# EasyEDA Pro project RK3568_DEV.epro, schematic Schematic1, sheets 13 to 24 of 27

## Sheets
13 WIFI: Create Date: 2025-09-11; Page Name: WIFI; Project Name: RK3568B2地瓜派; Update Date: 2025-09-15
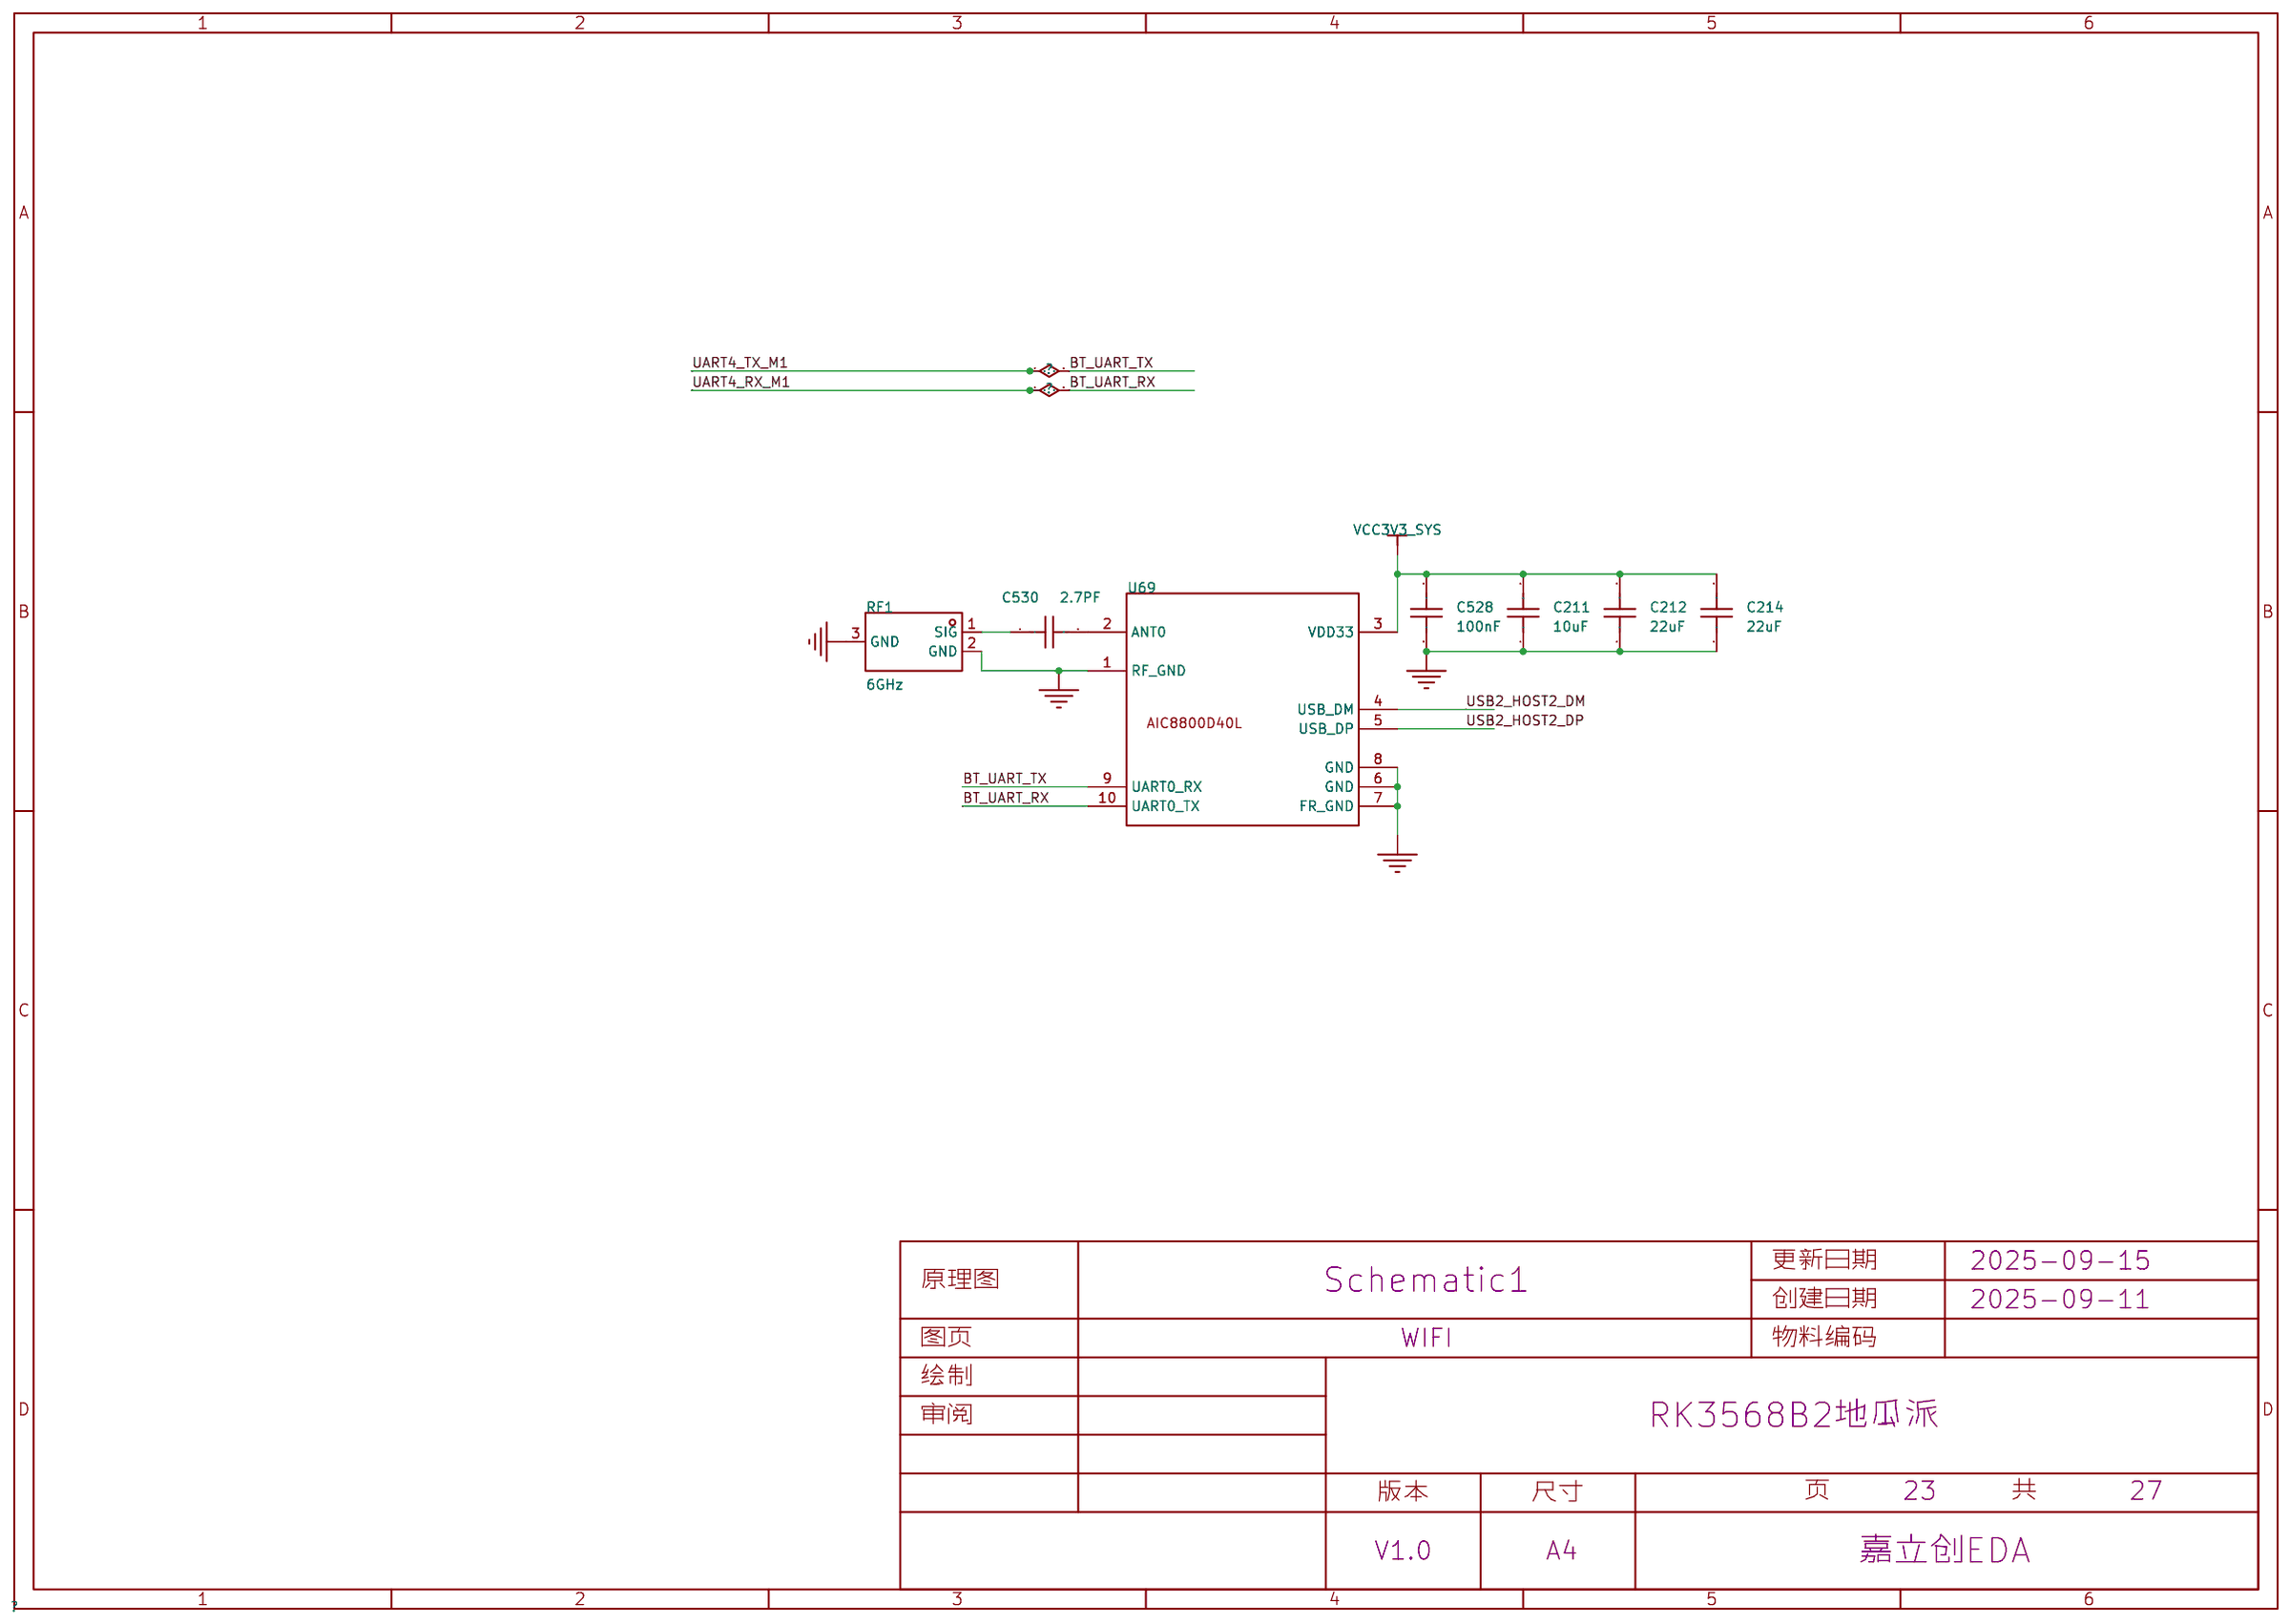
[diagram p12: WIFI]
14 SOC_MAC/SAR/I2S: Page Name: SOC_MAC/SAR/I2S
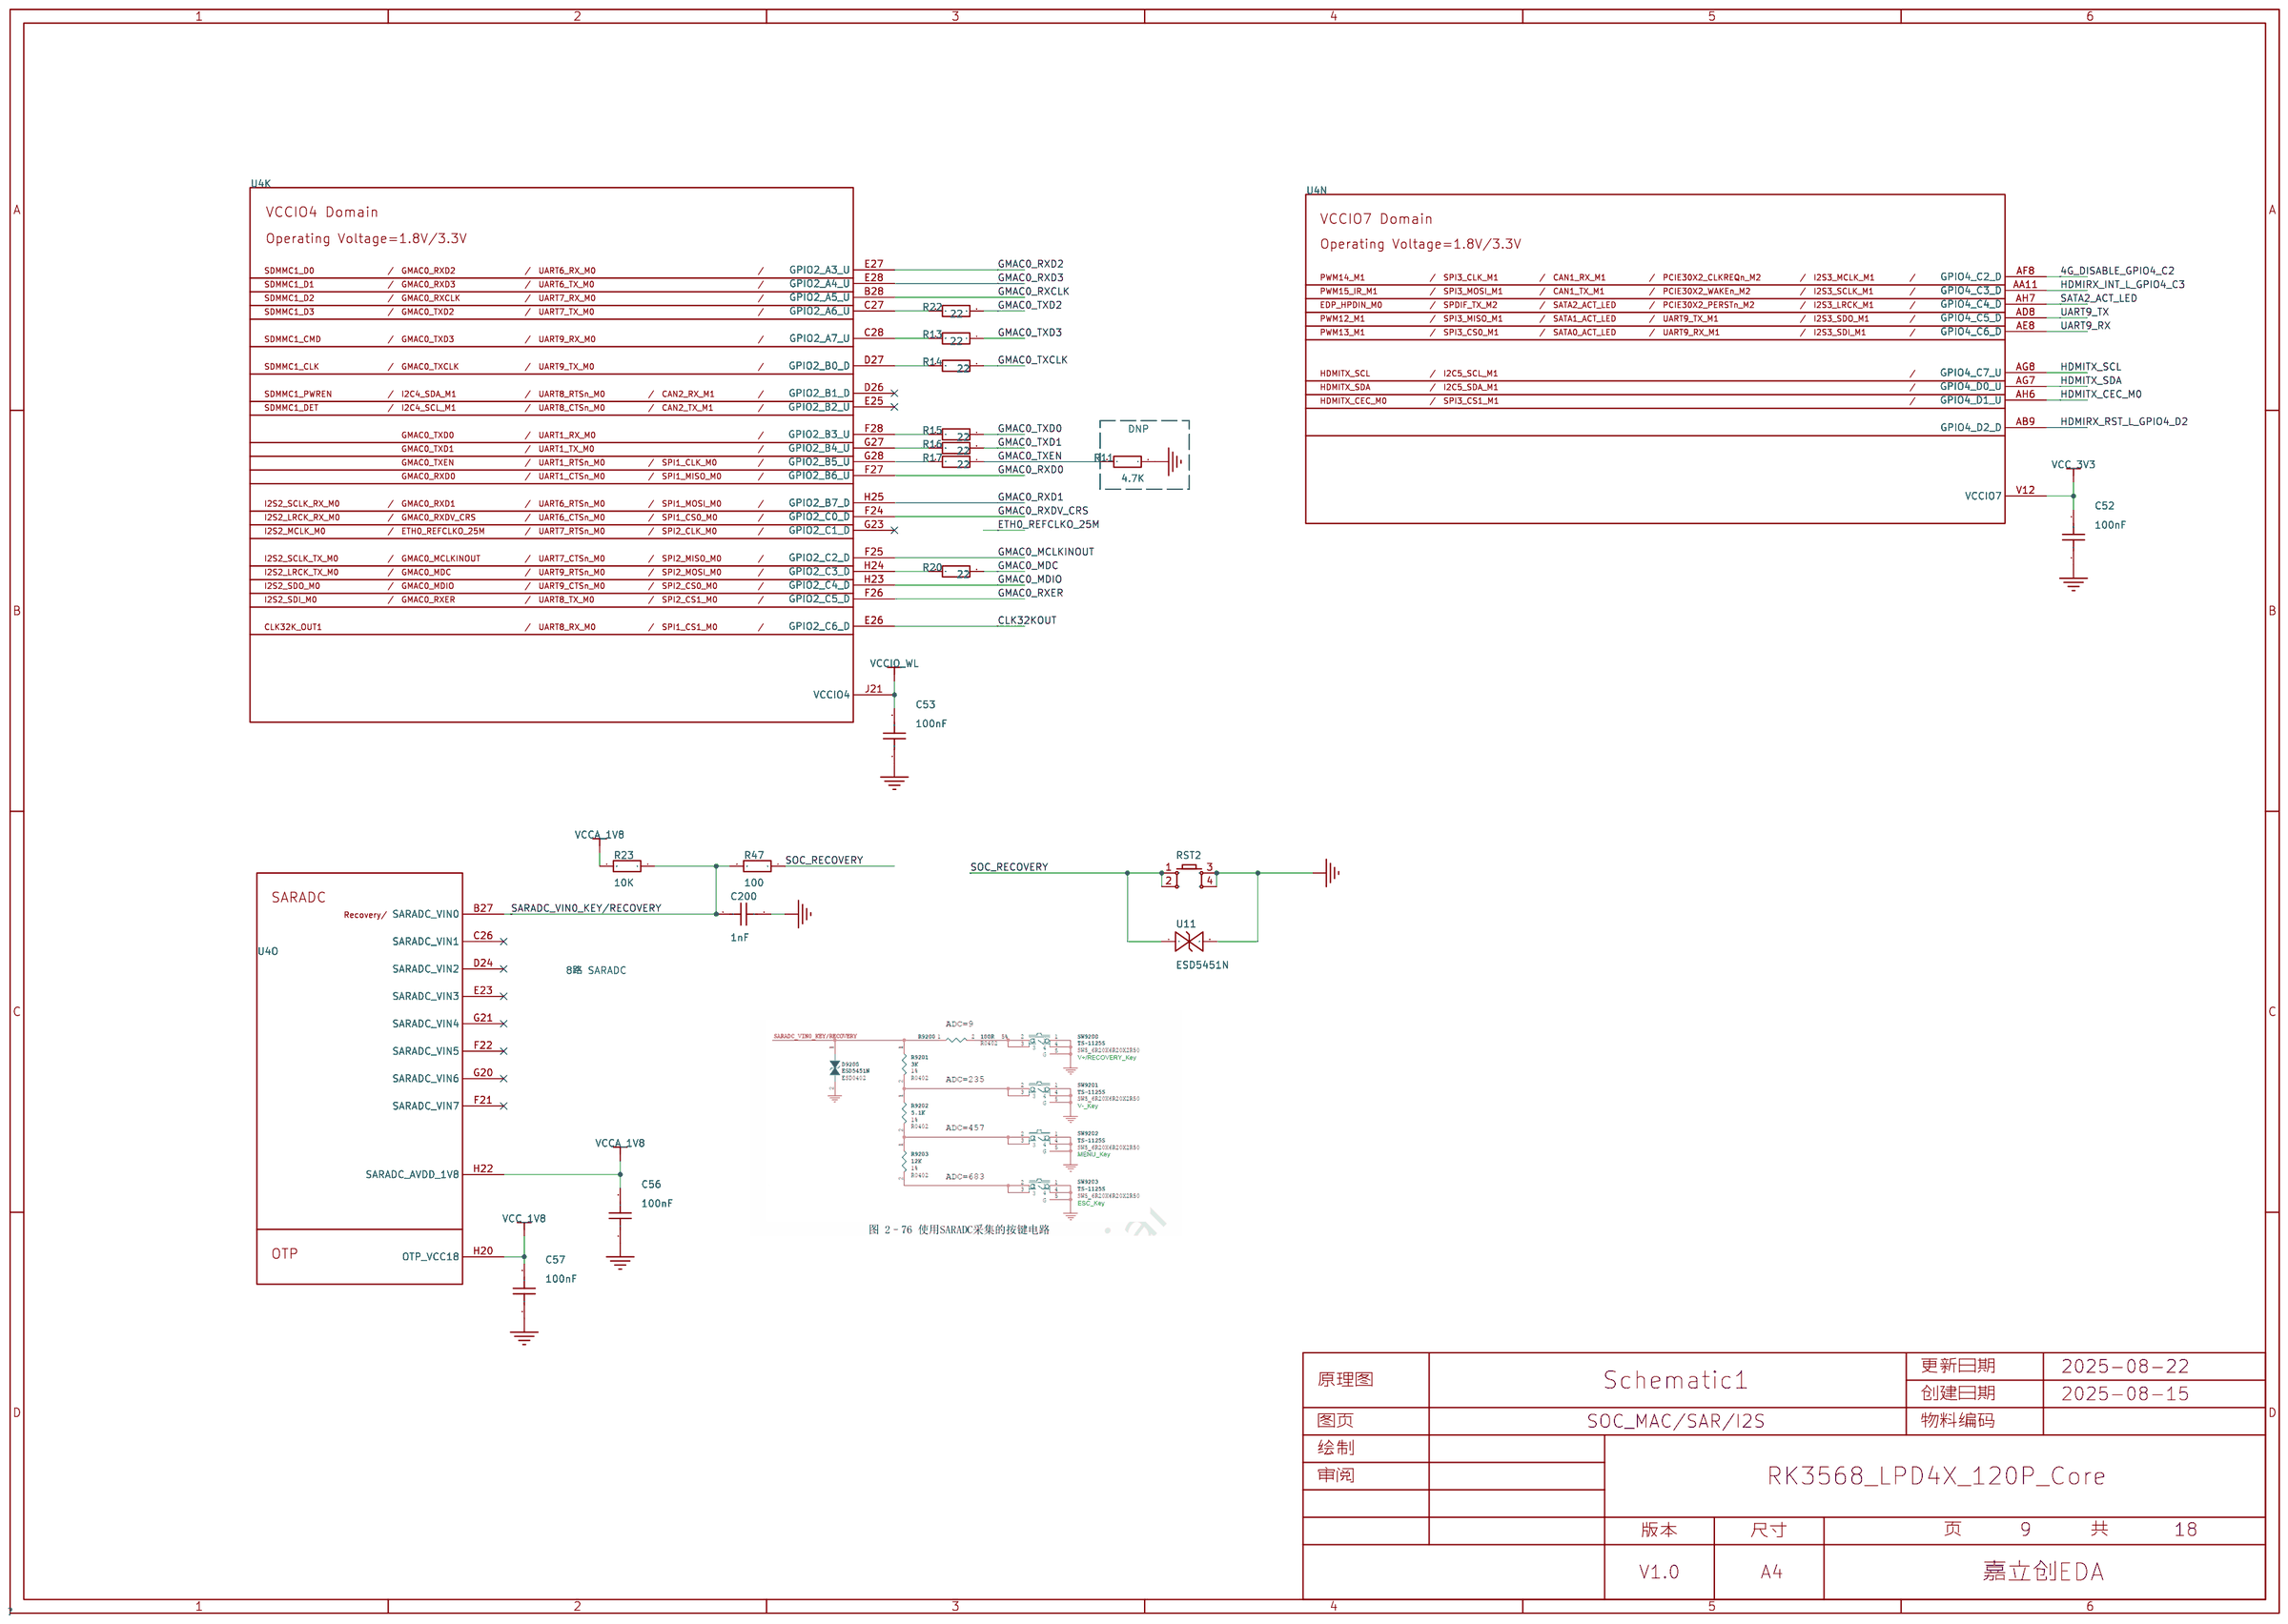
[diagram p13: SOC_MAC/SAR/I2S]
15 DISPLAY: Create Date: 2025-09-11; Page Name: DISPLAY; Project Name: RK3568B2地瓜派; Update Date: 2025-09-23
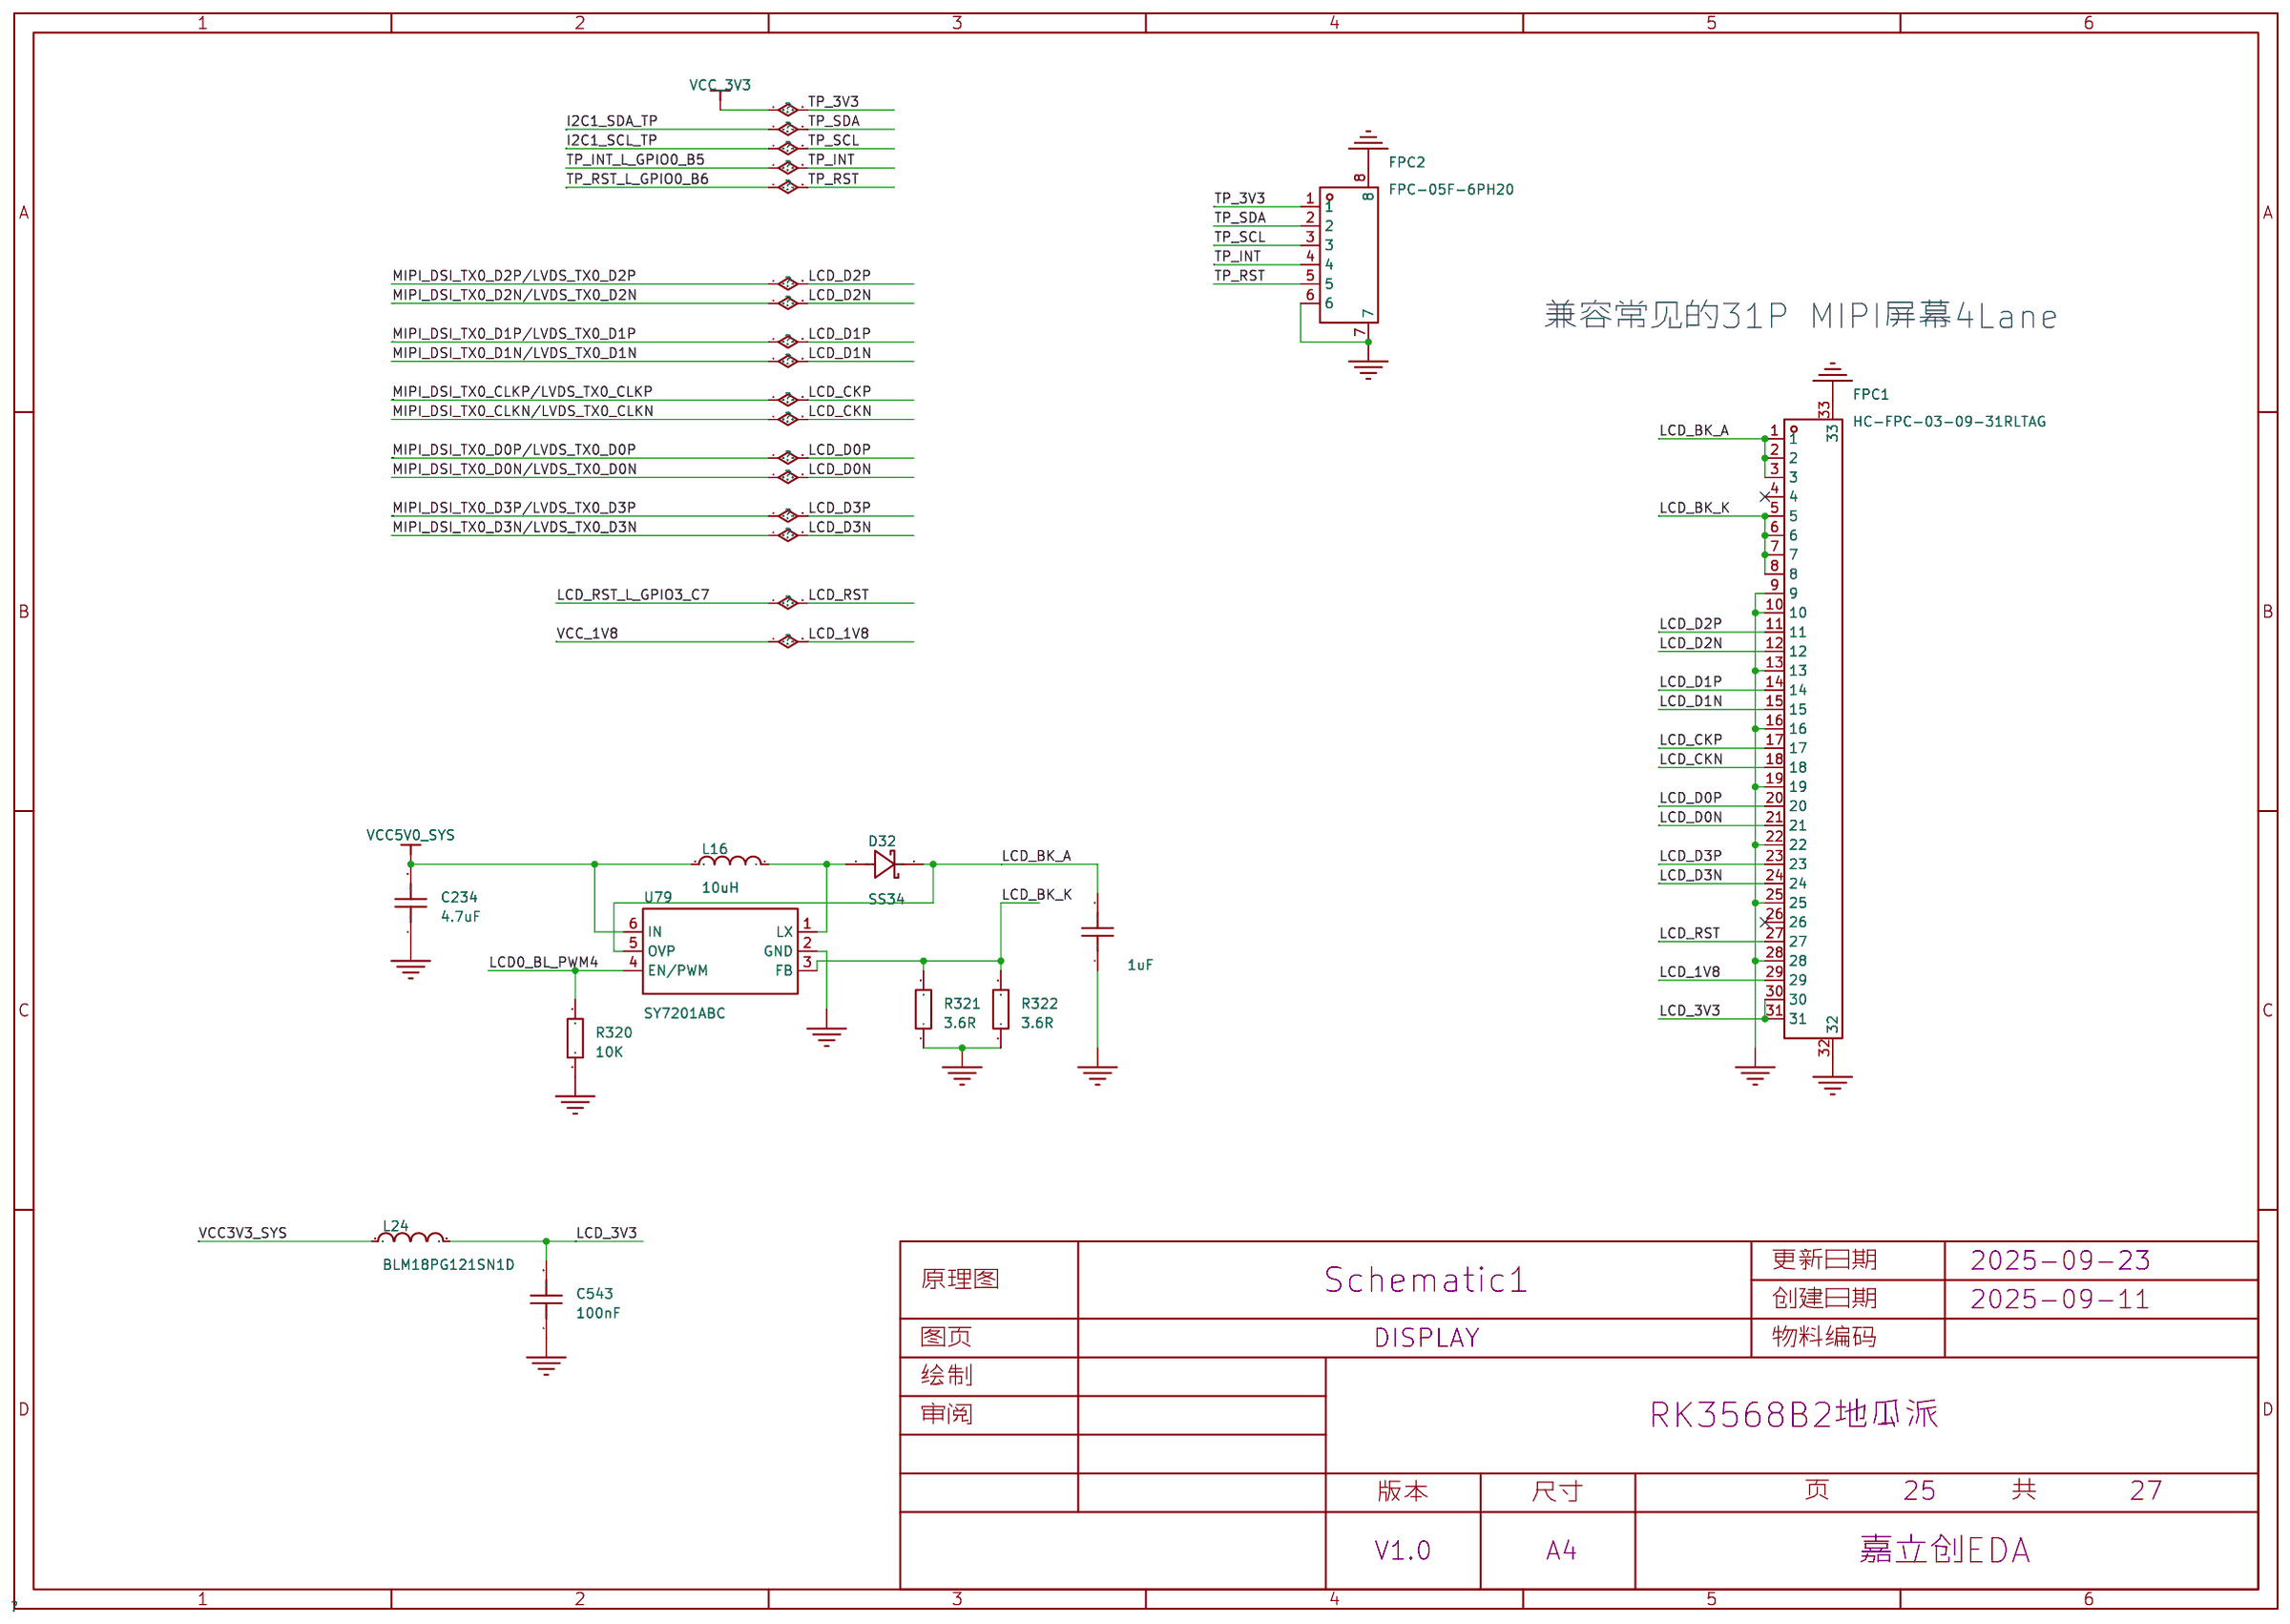
[diagram p14: DISPLAY]
16 AUDIO: Create Date: 2025-09-11; Page Name: AUDIO; Project Name: RK3568B2地瓜派; Update Date: 2025-09-15
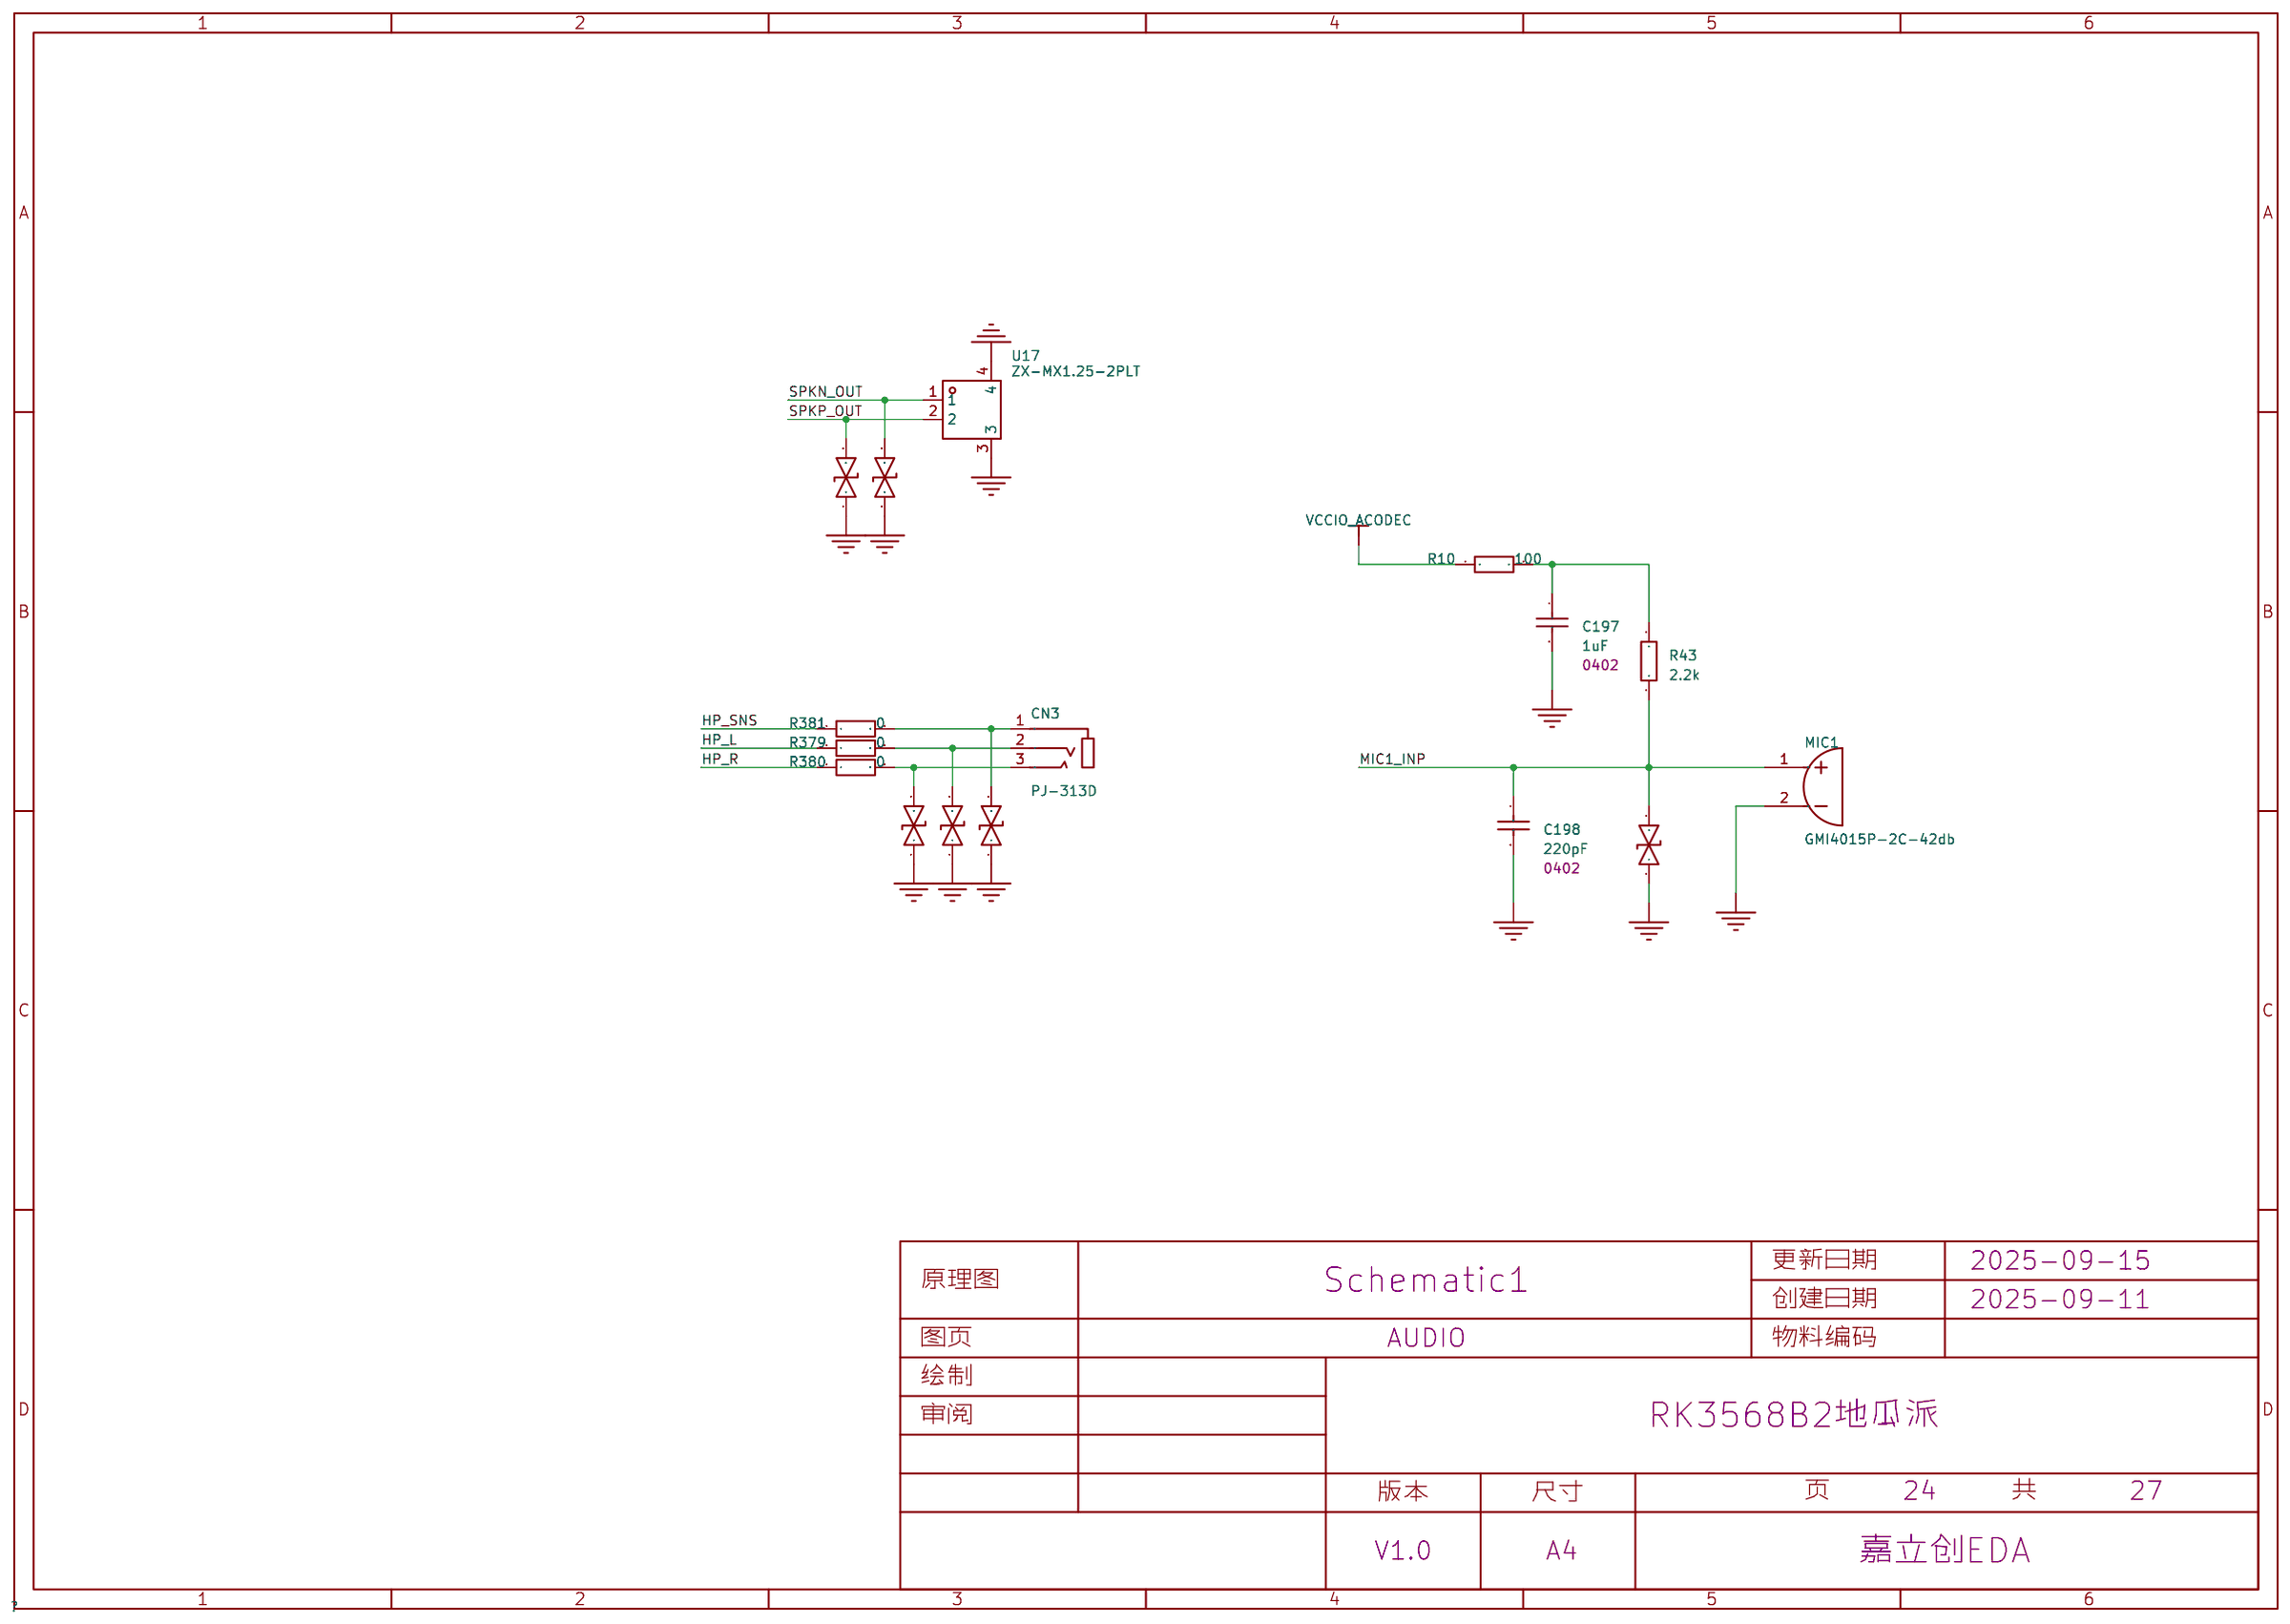
[diagram p15: AUDIO]
17 IO资源引出: Create Date: 2025-09-11; Page Name: IO资源引出; Project Name: RK3568B2地瓜派; Update Date: 2025-09-12
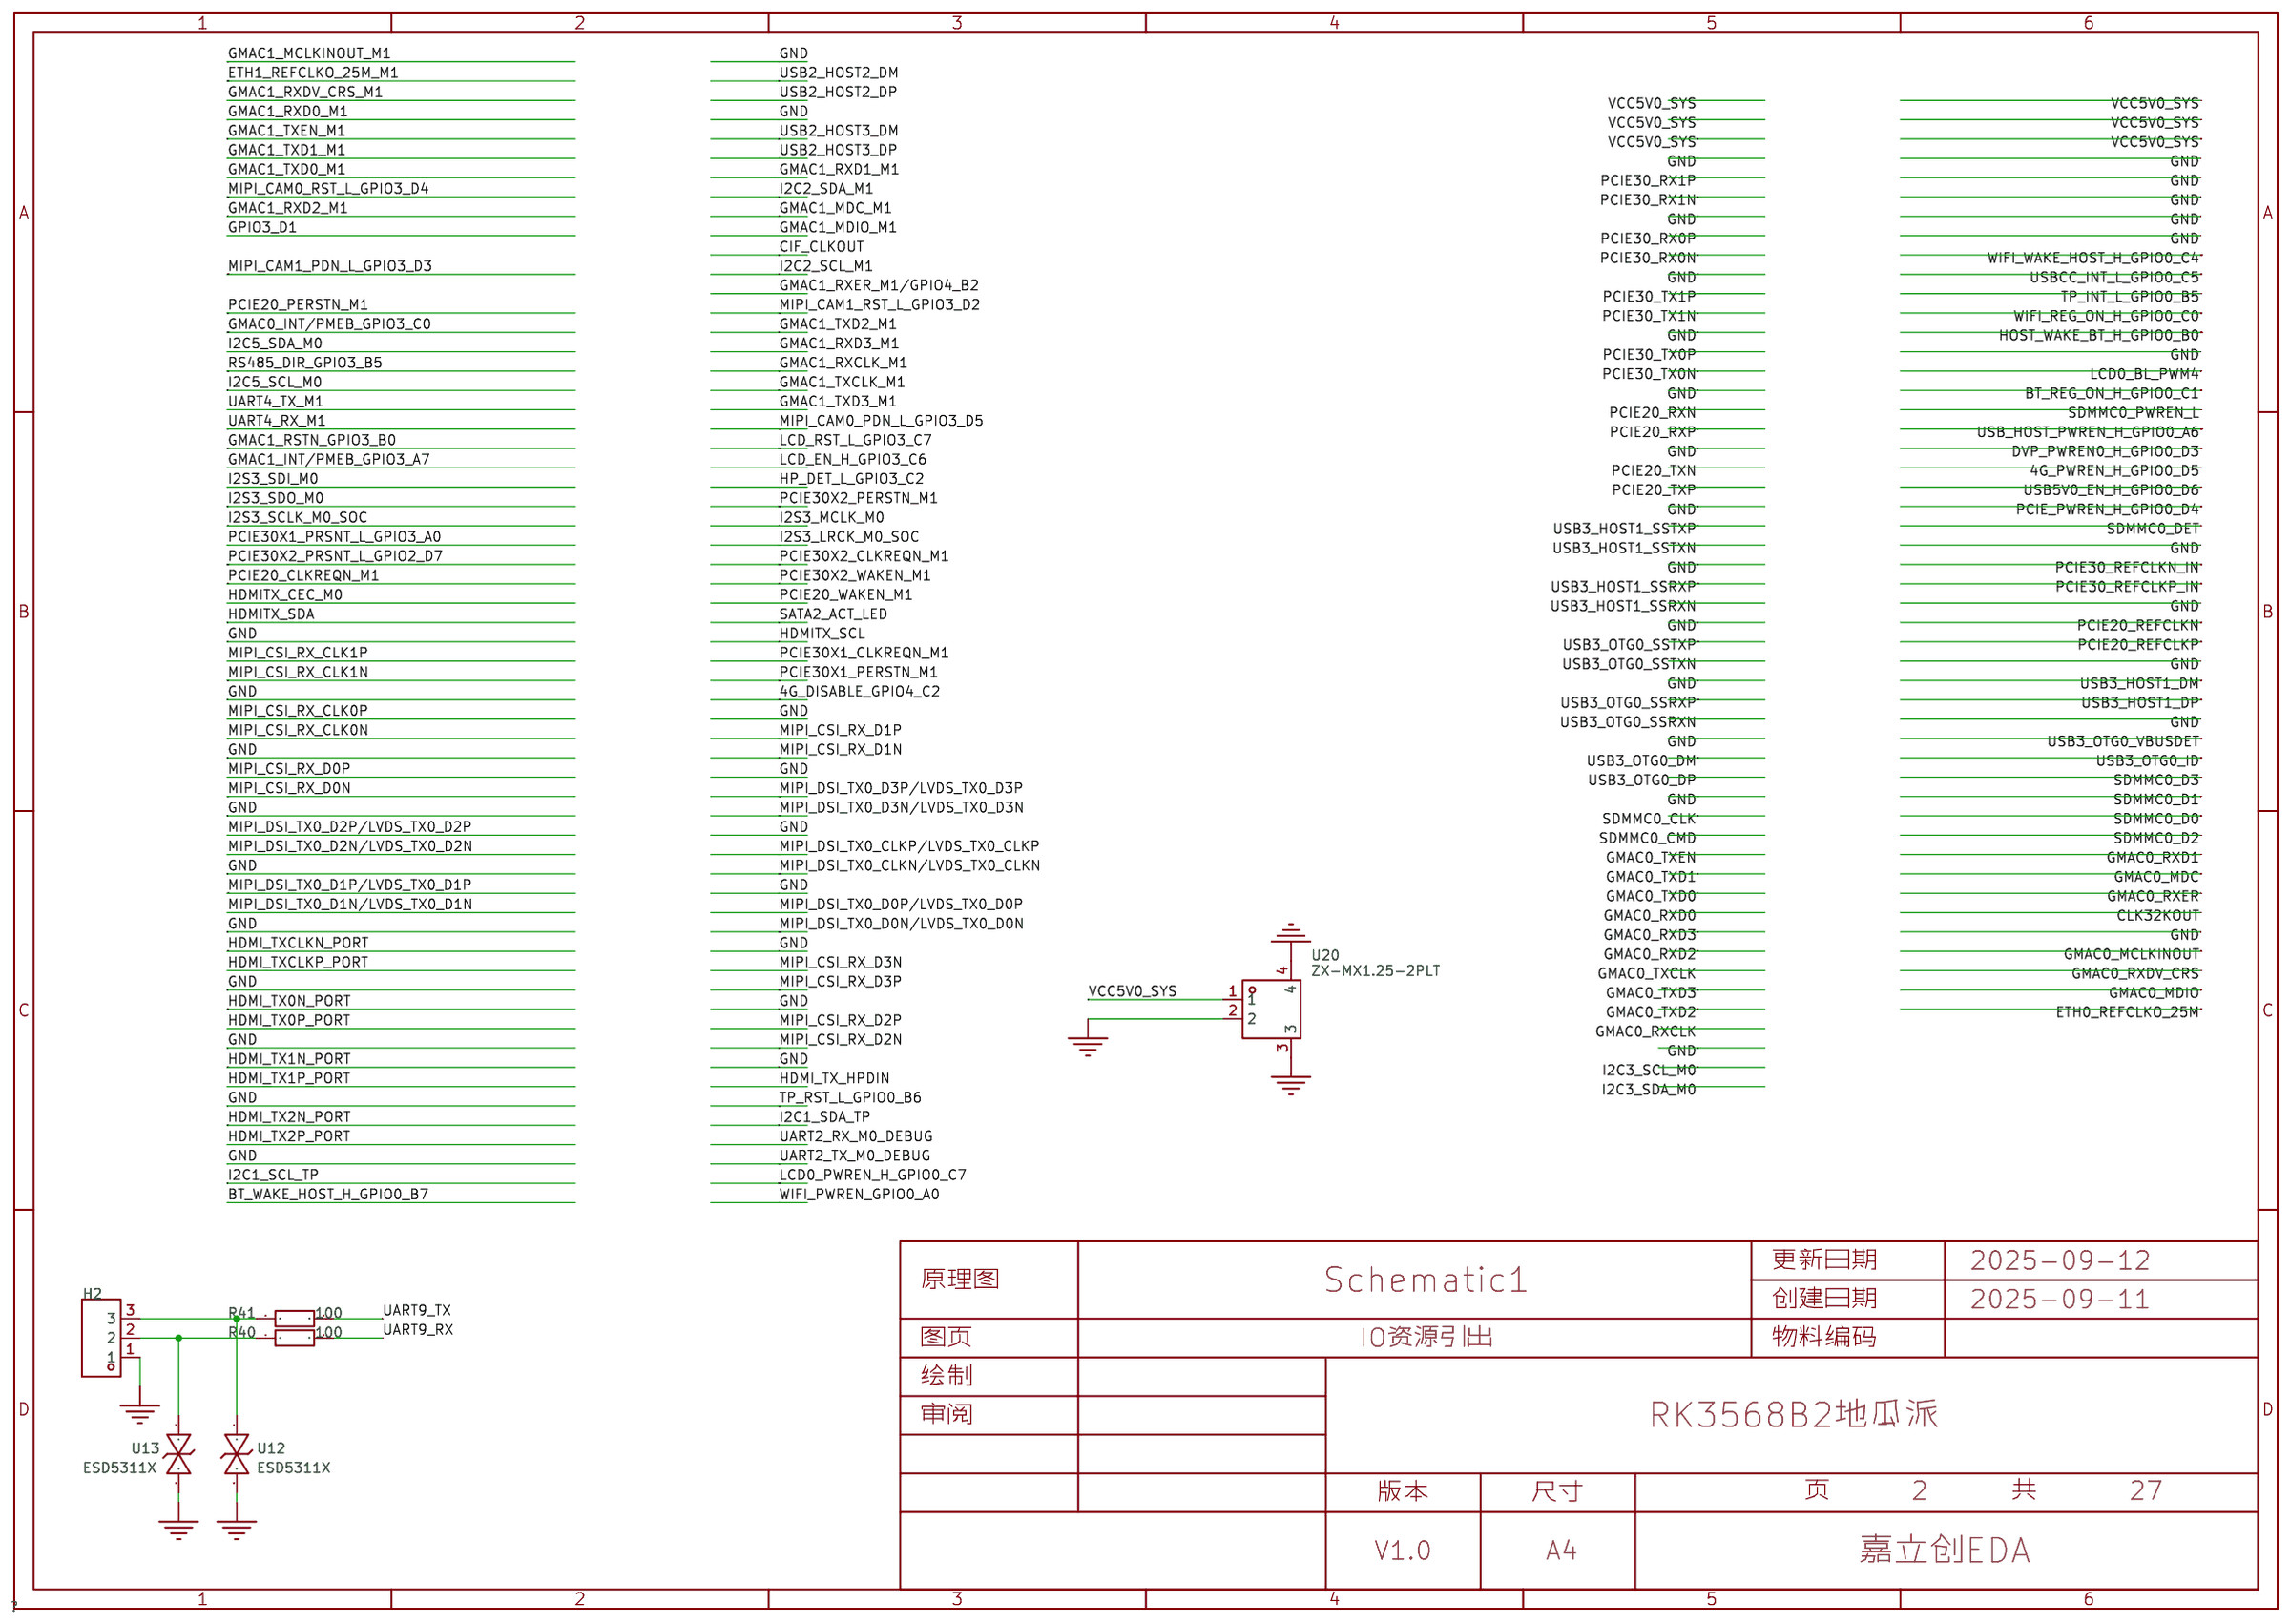
[diagram p16: IO资源引出]
18 SOC_DDR: Create Date: 2025-09-11; Page Name: SOC_DDR; Project Name: RK3568B2地瓜派; Update Date: 2025-09-11
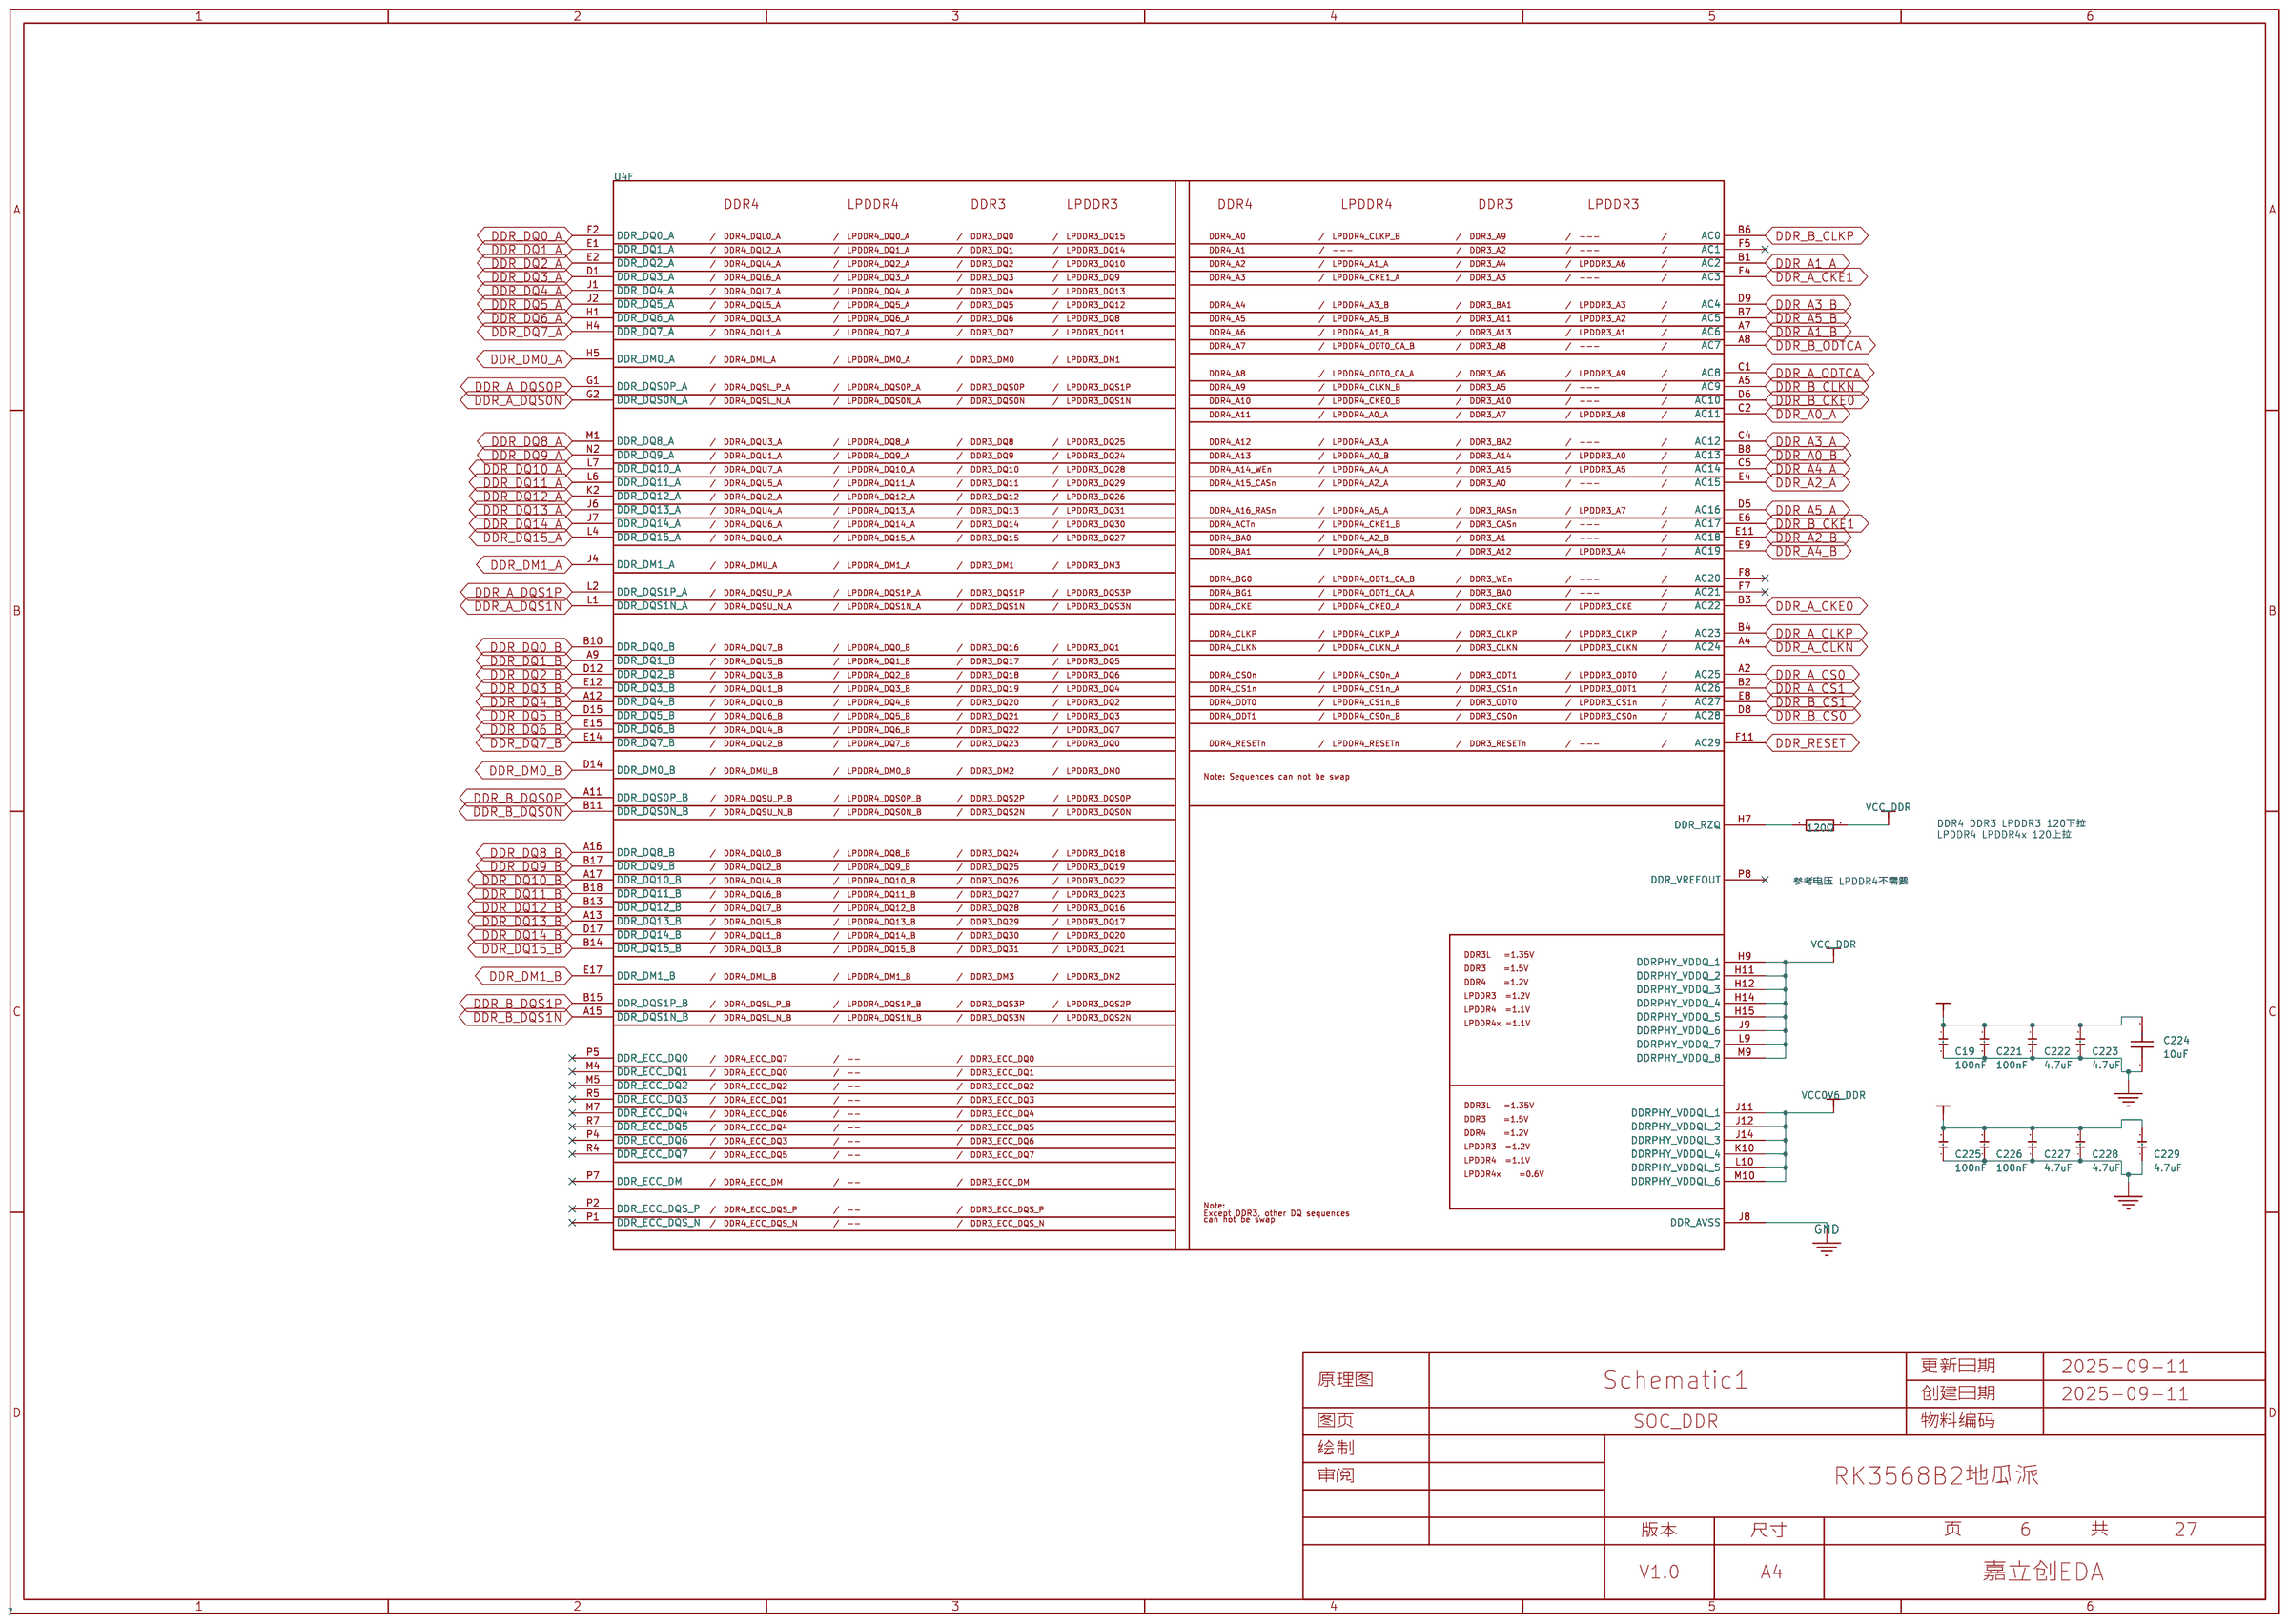
[diagram p17: SOC_DDR]
19 SOC_DISPLAY: Page Name: SOC_DISPLAY; Update Date: 2025-08-25
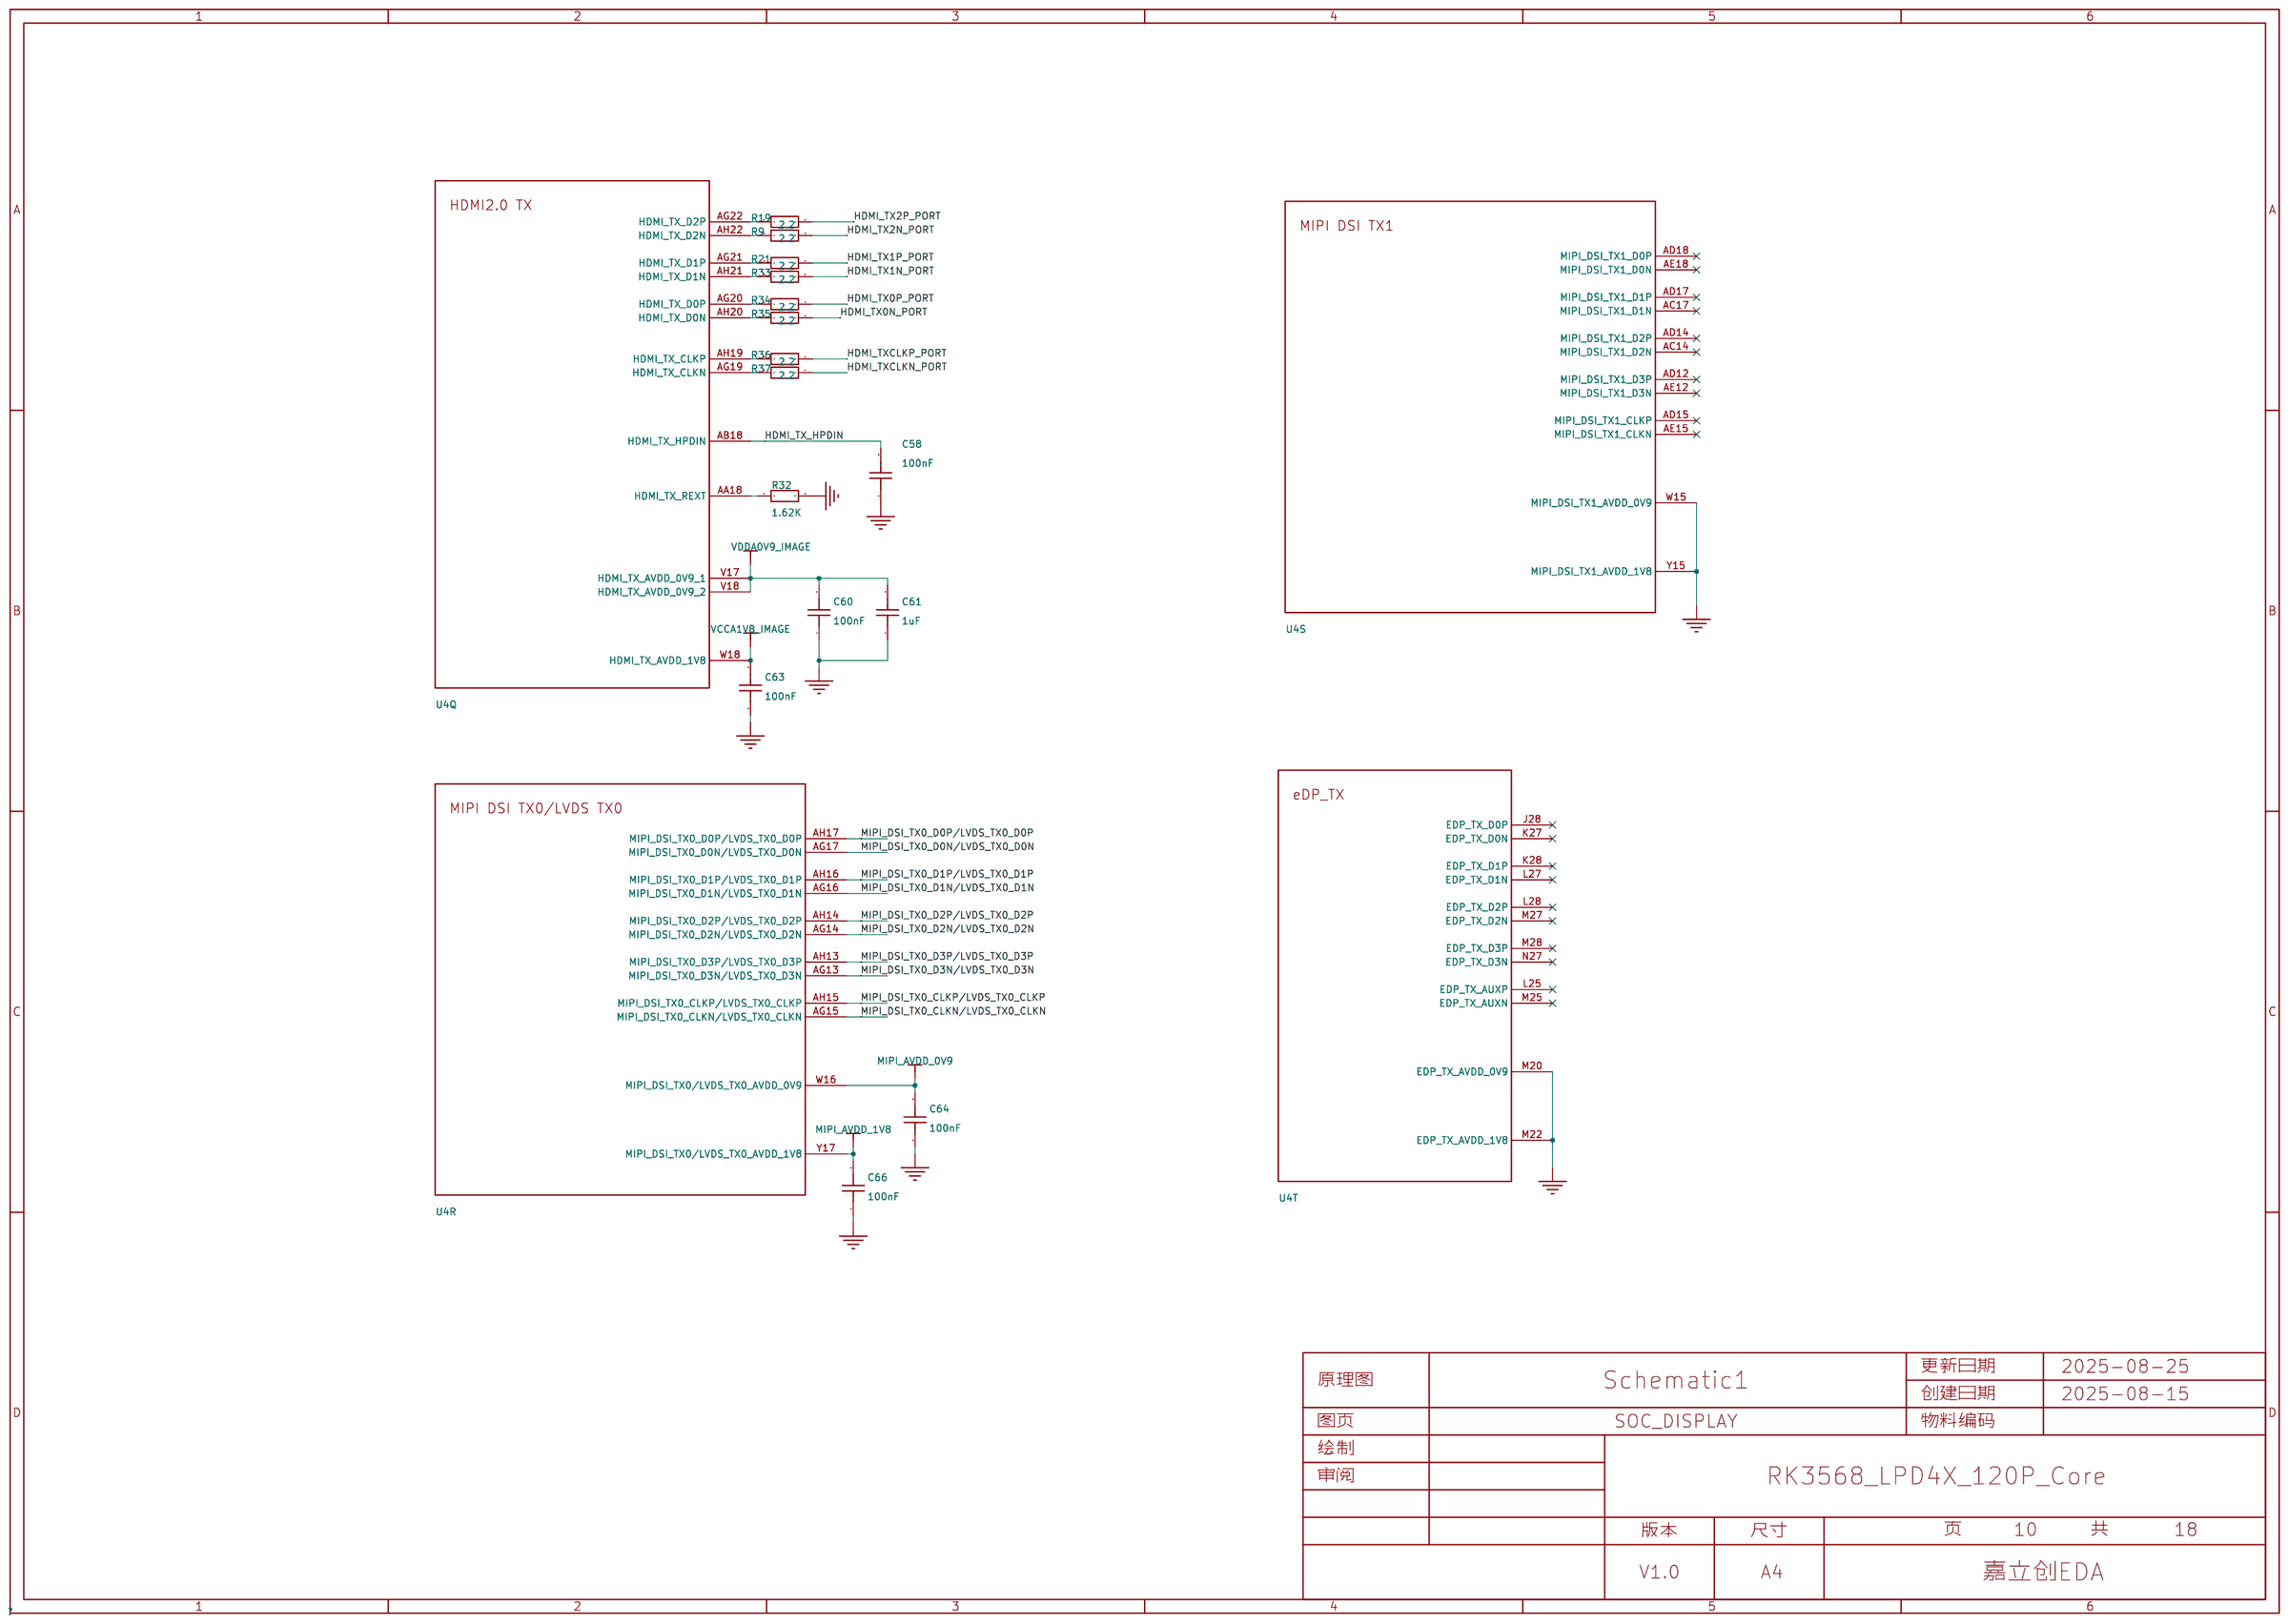
[diagram p18: SOC_DISPLAY]
20 SOC_IO: Create Date: 2025-09-11; Page Name: SOC_IO; Project Name: RK3568B2地瓜派; Update Date: 2025-09-11
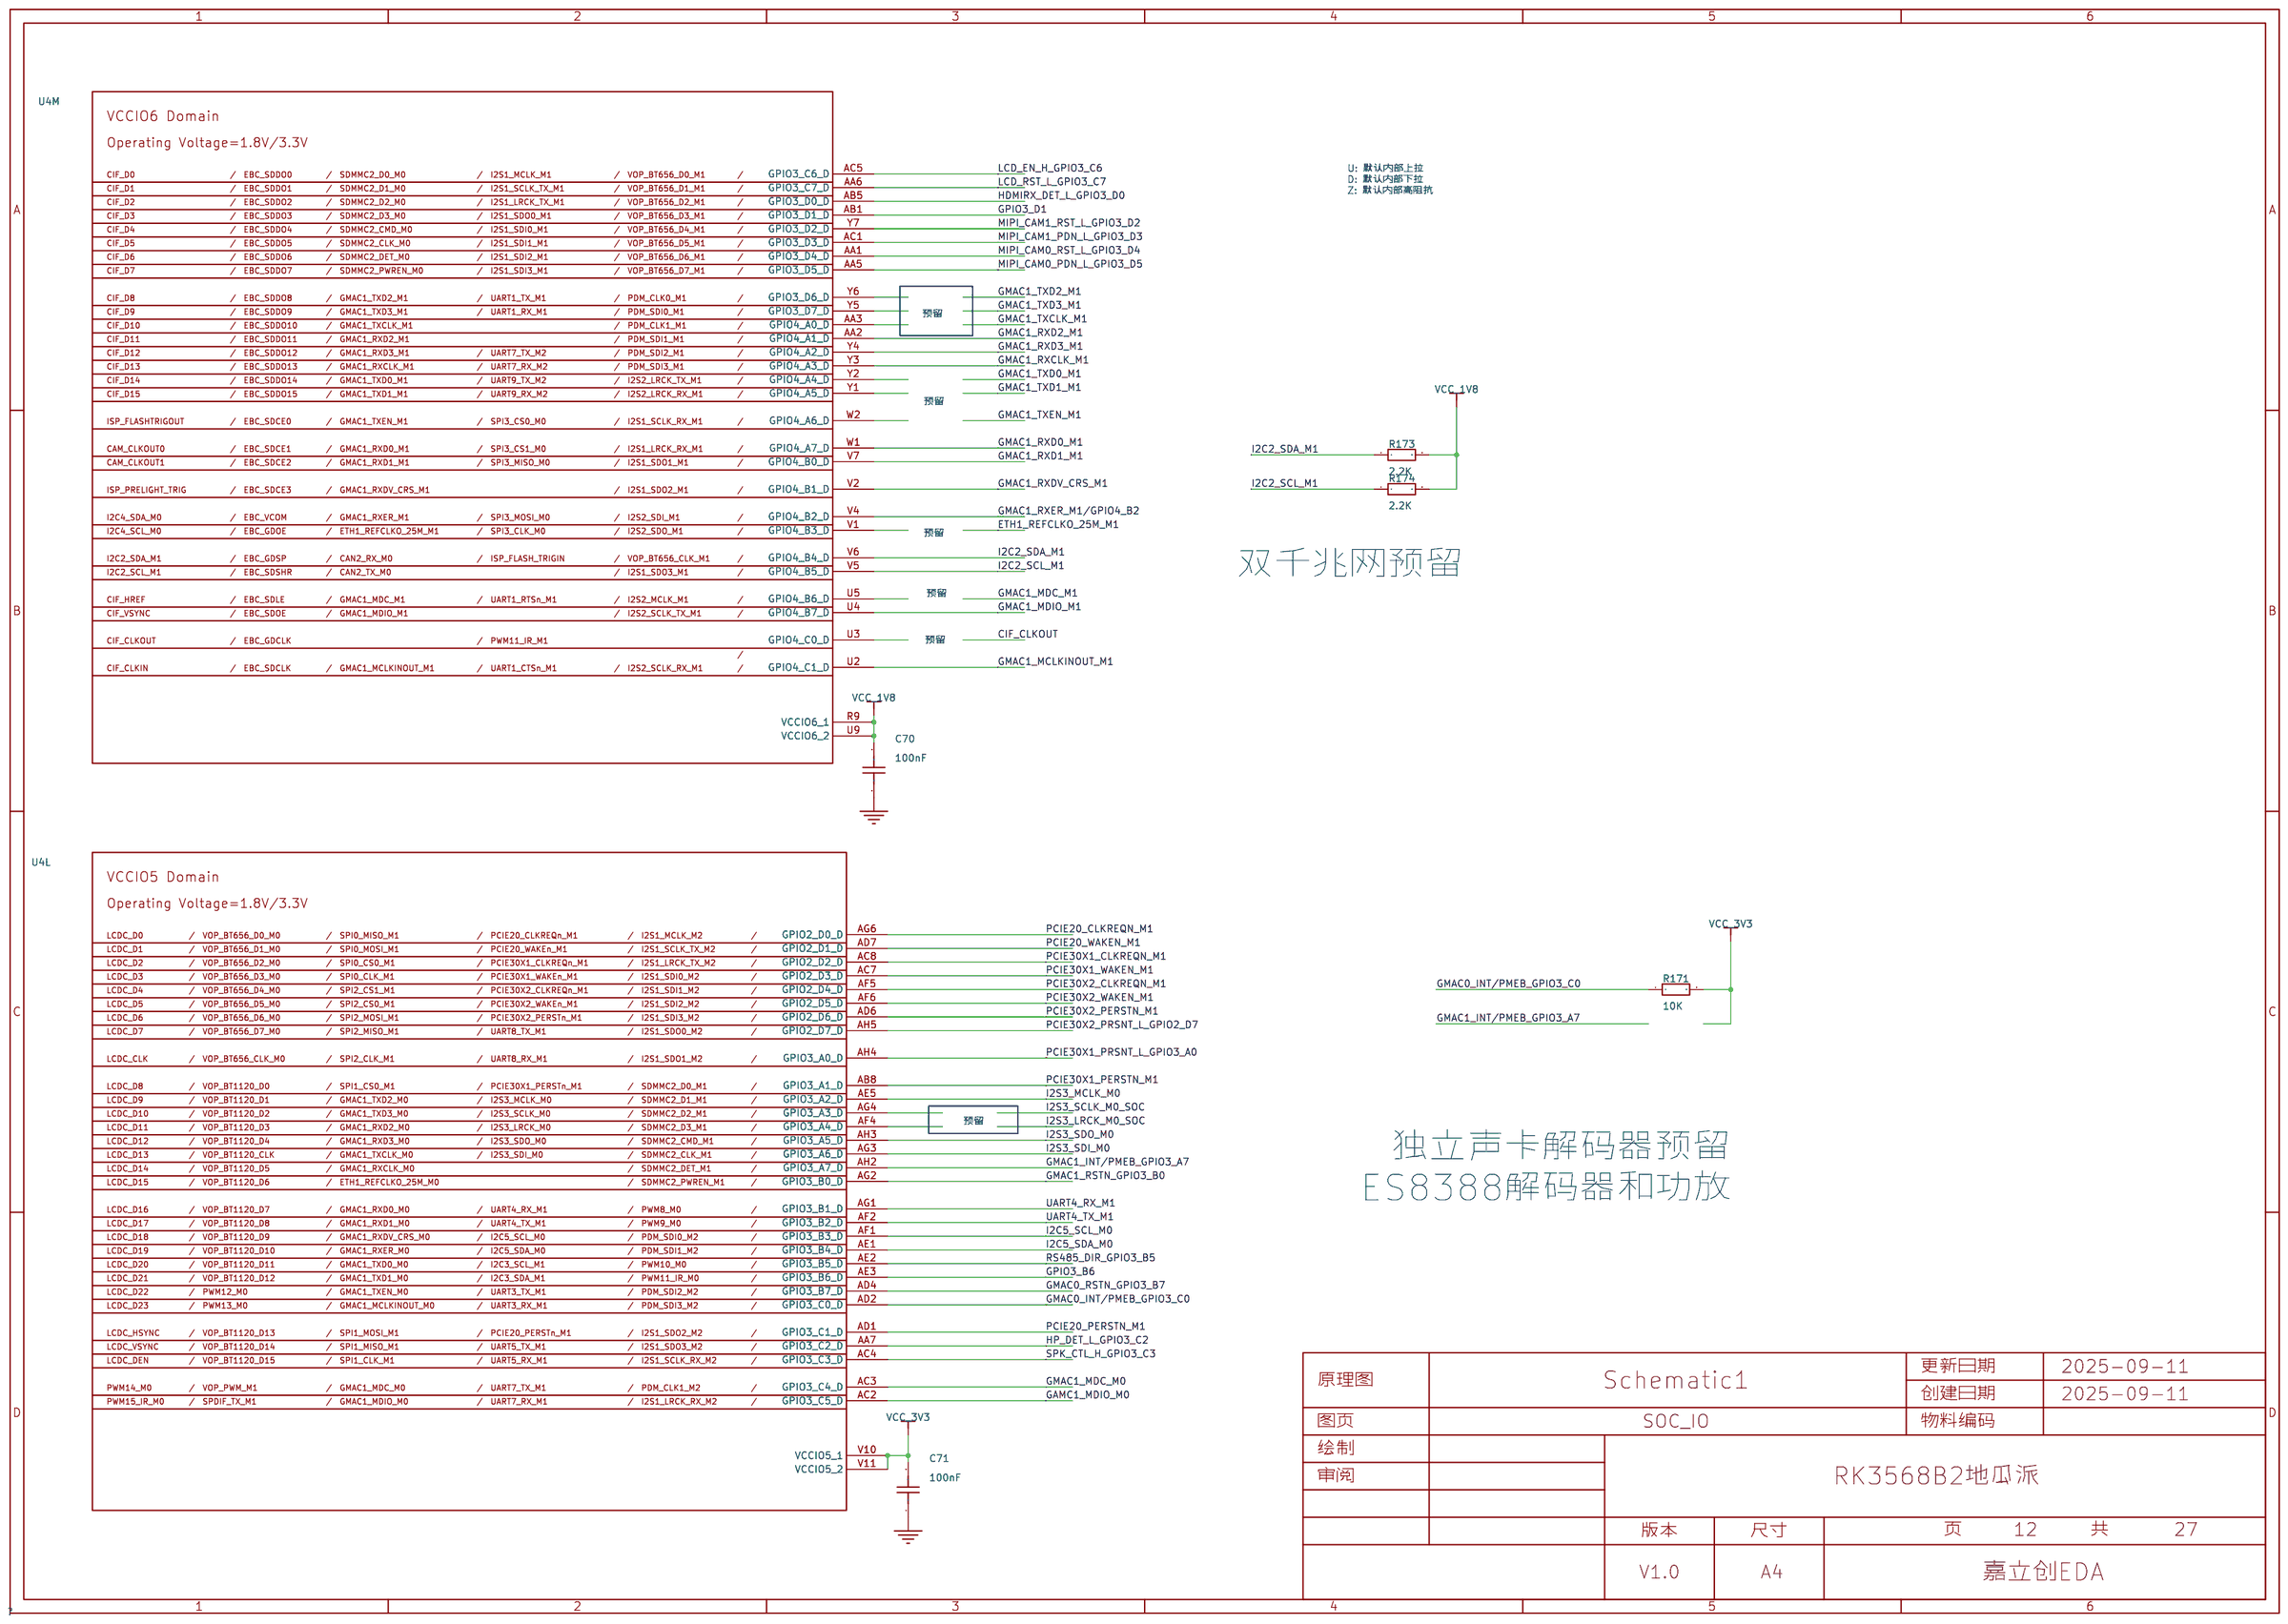
[diagram p19: SOC_IO]
21 SOC_SOUND: Create Date: 2025-09-11; Page Name: SOC_SOUND; Project Name: RK3568B2地瓜派; Update Date: 2025-09-11
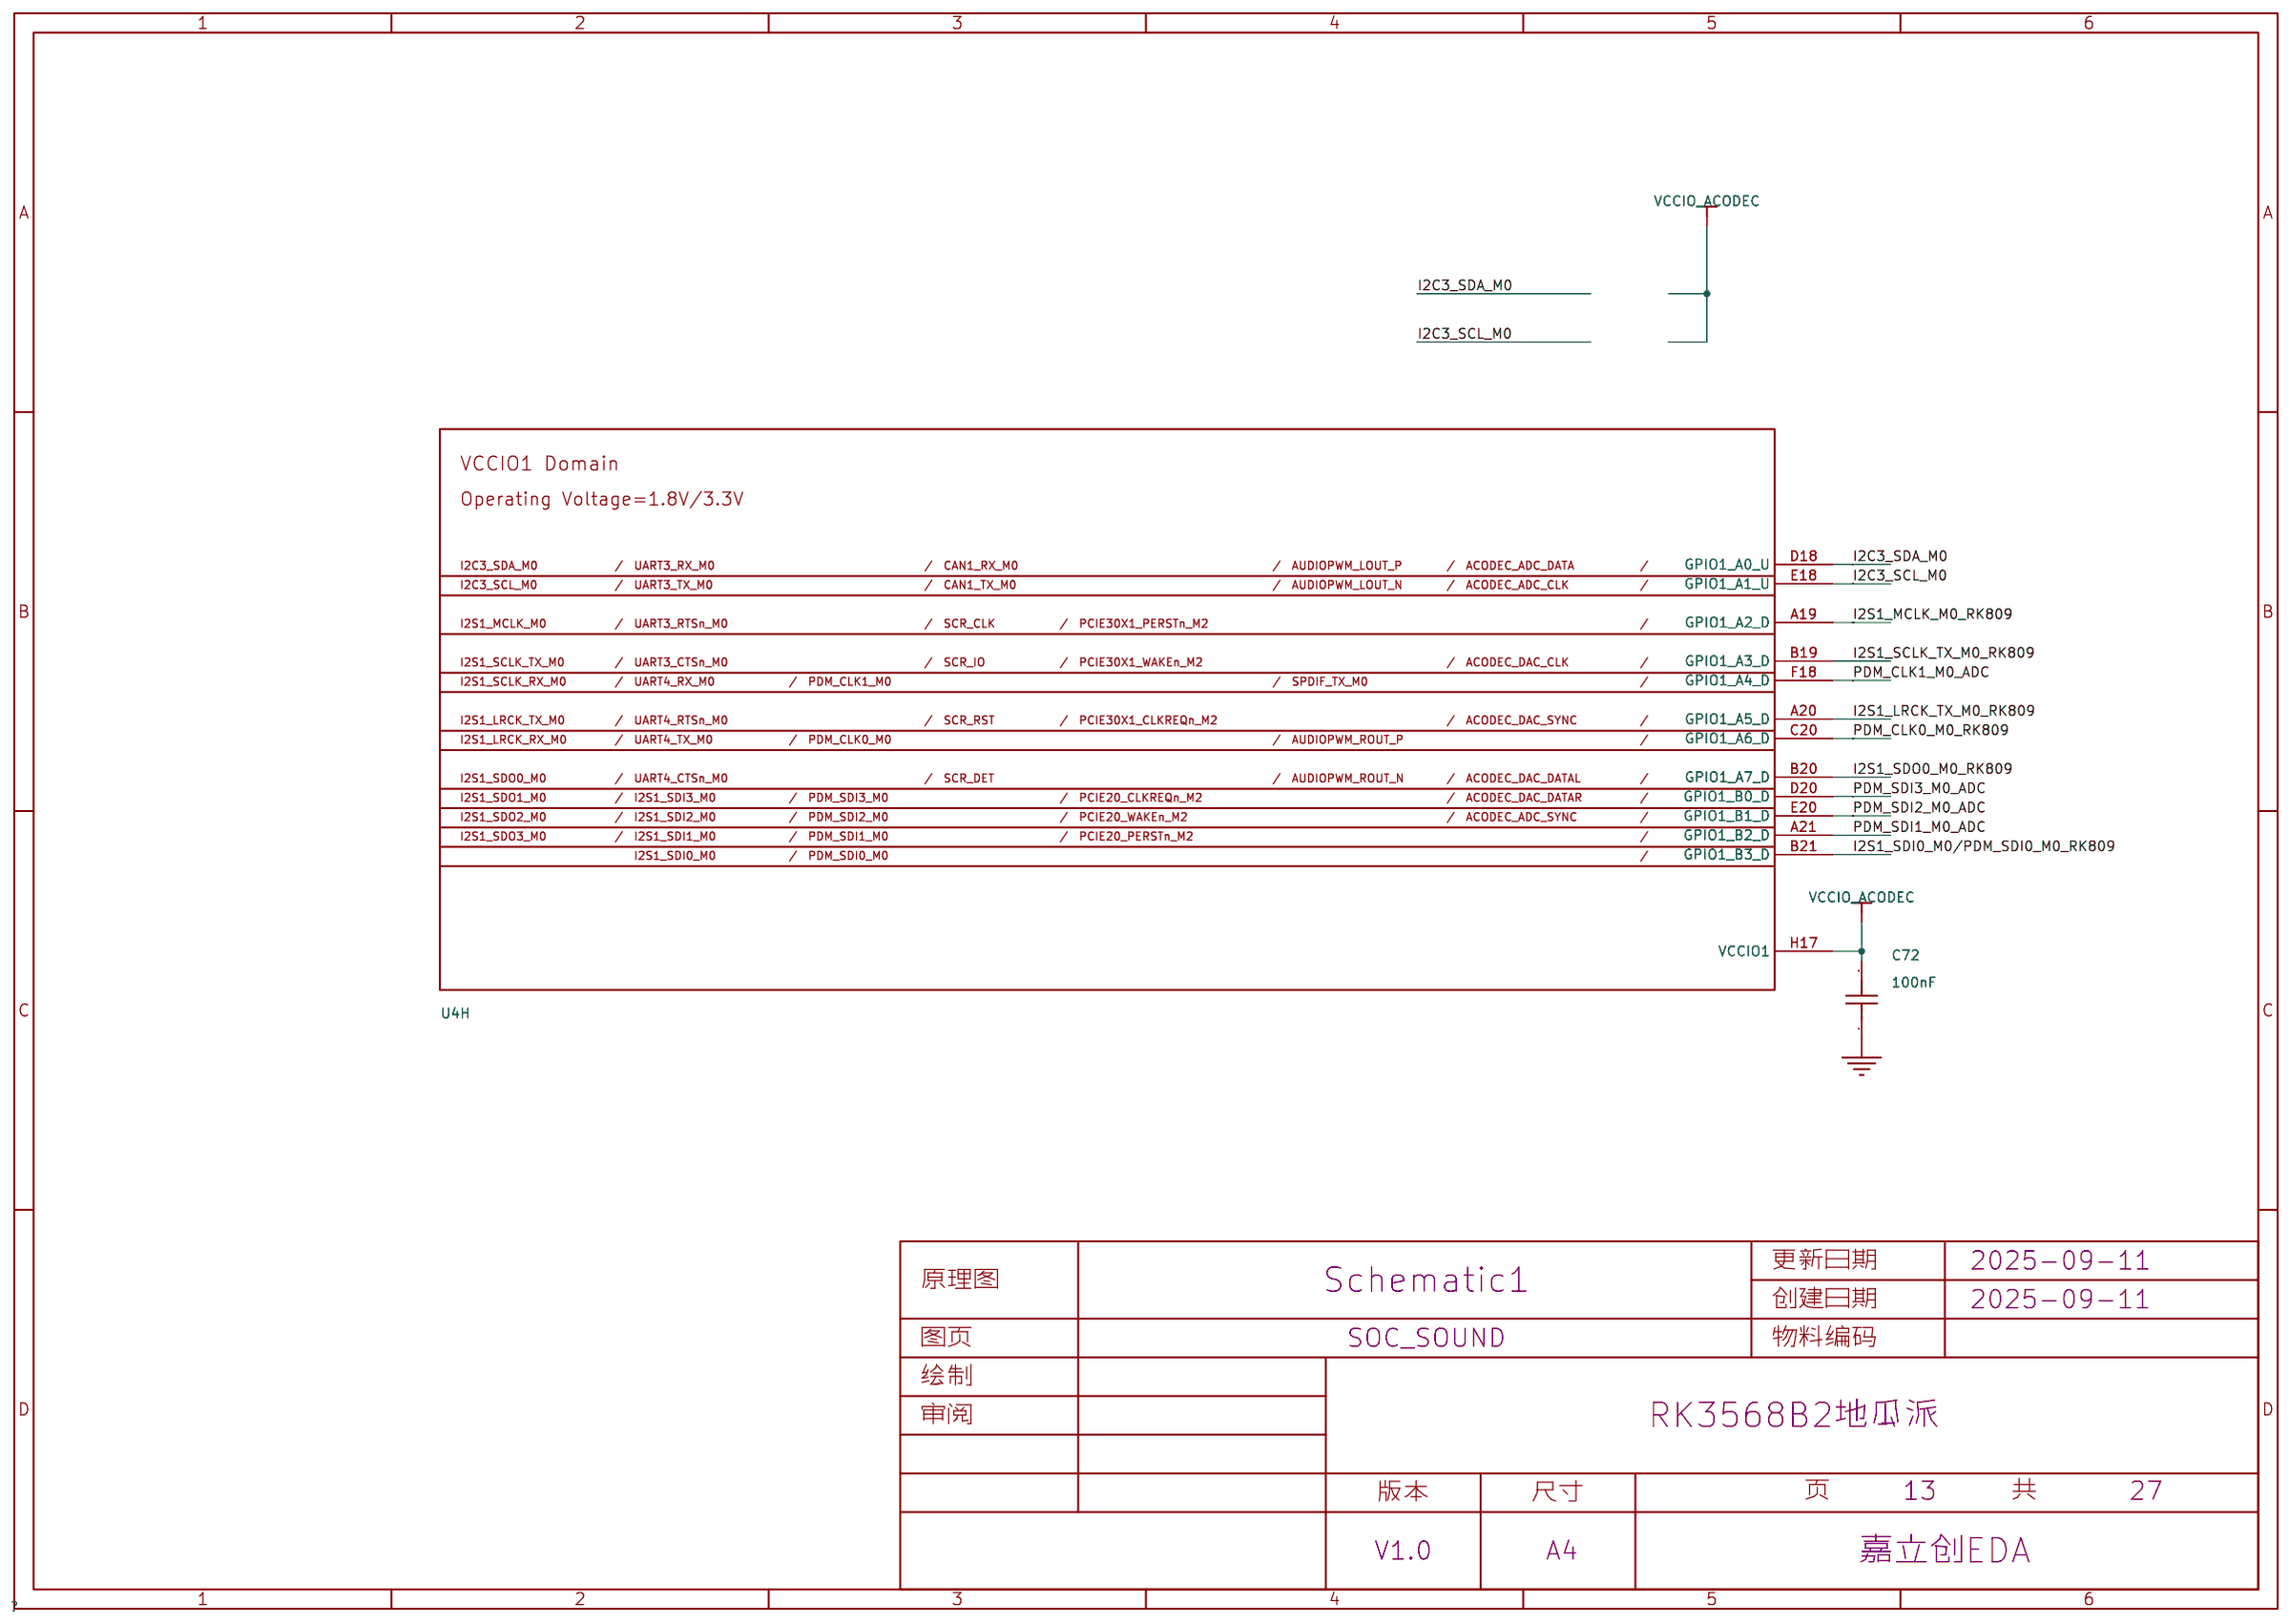
[diagram p20: SOC_SOUND]
22 SOC_COMPHY/USB: Page Name: SOC_COMPHY/USB
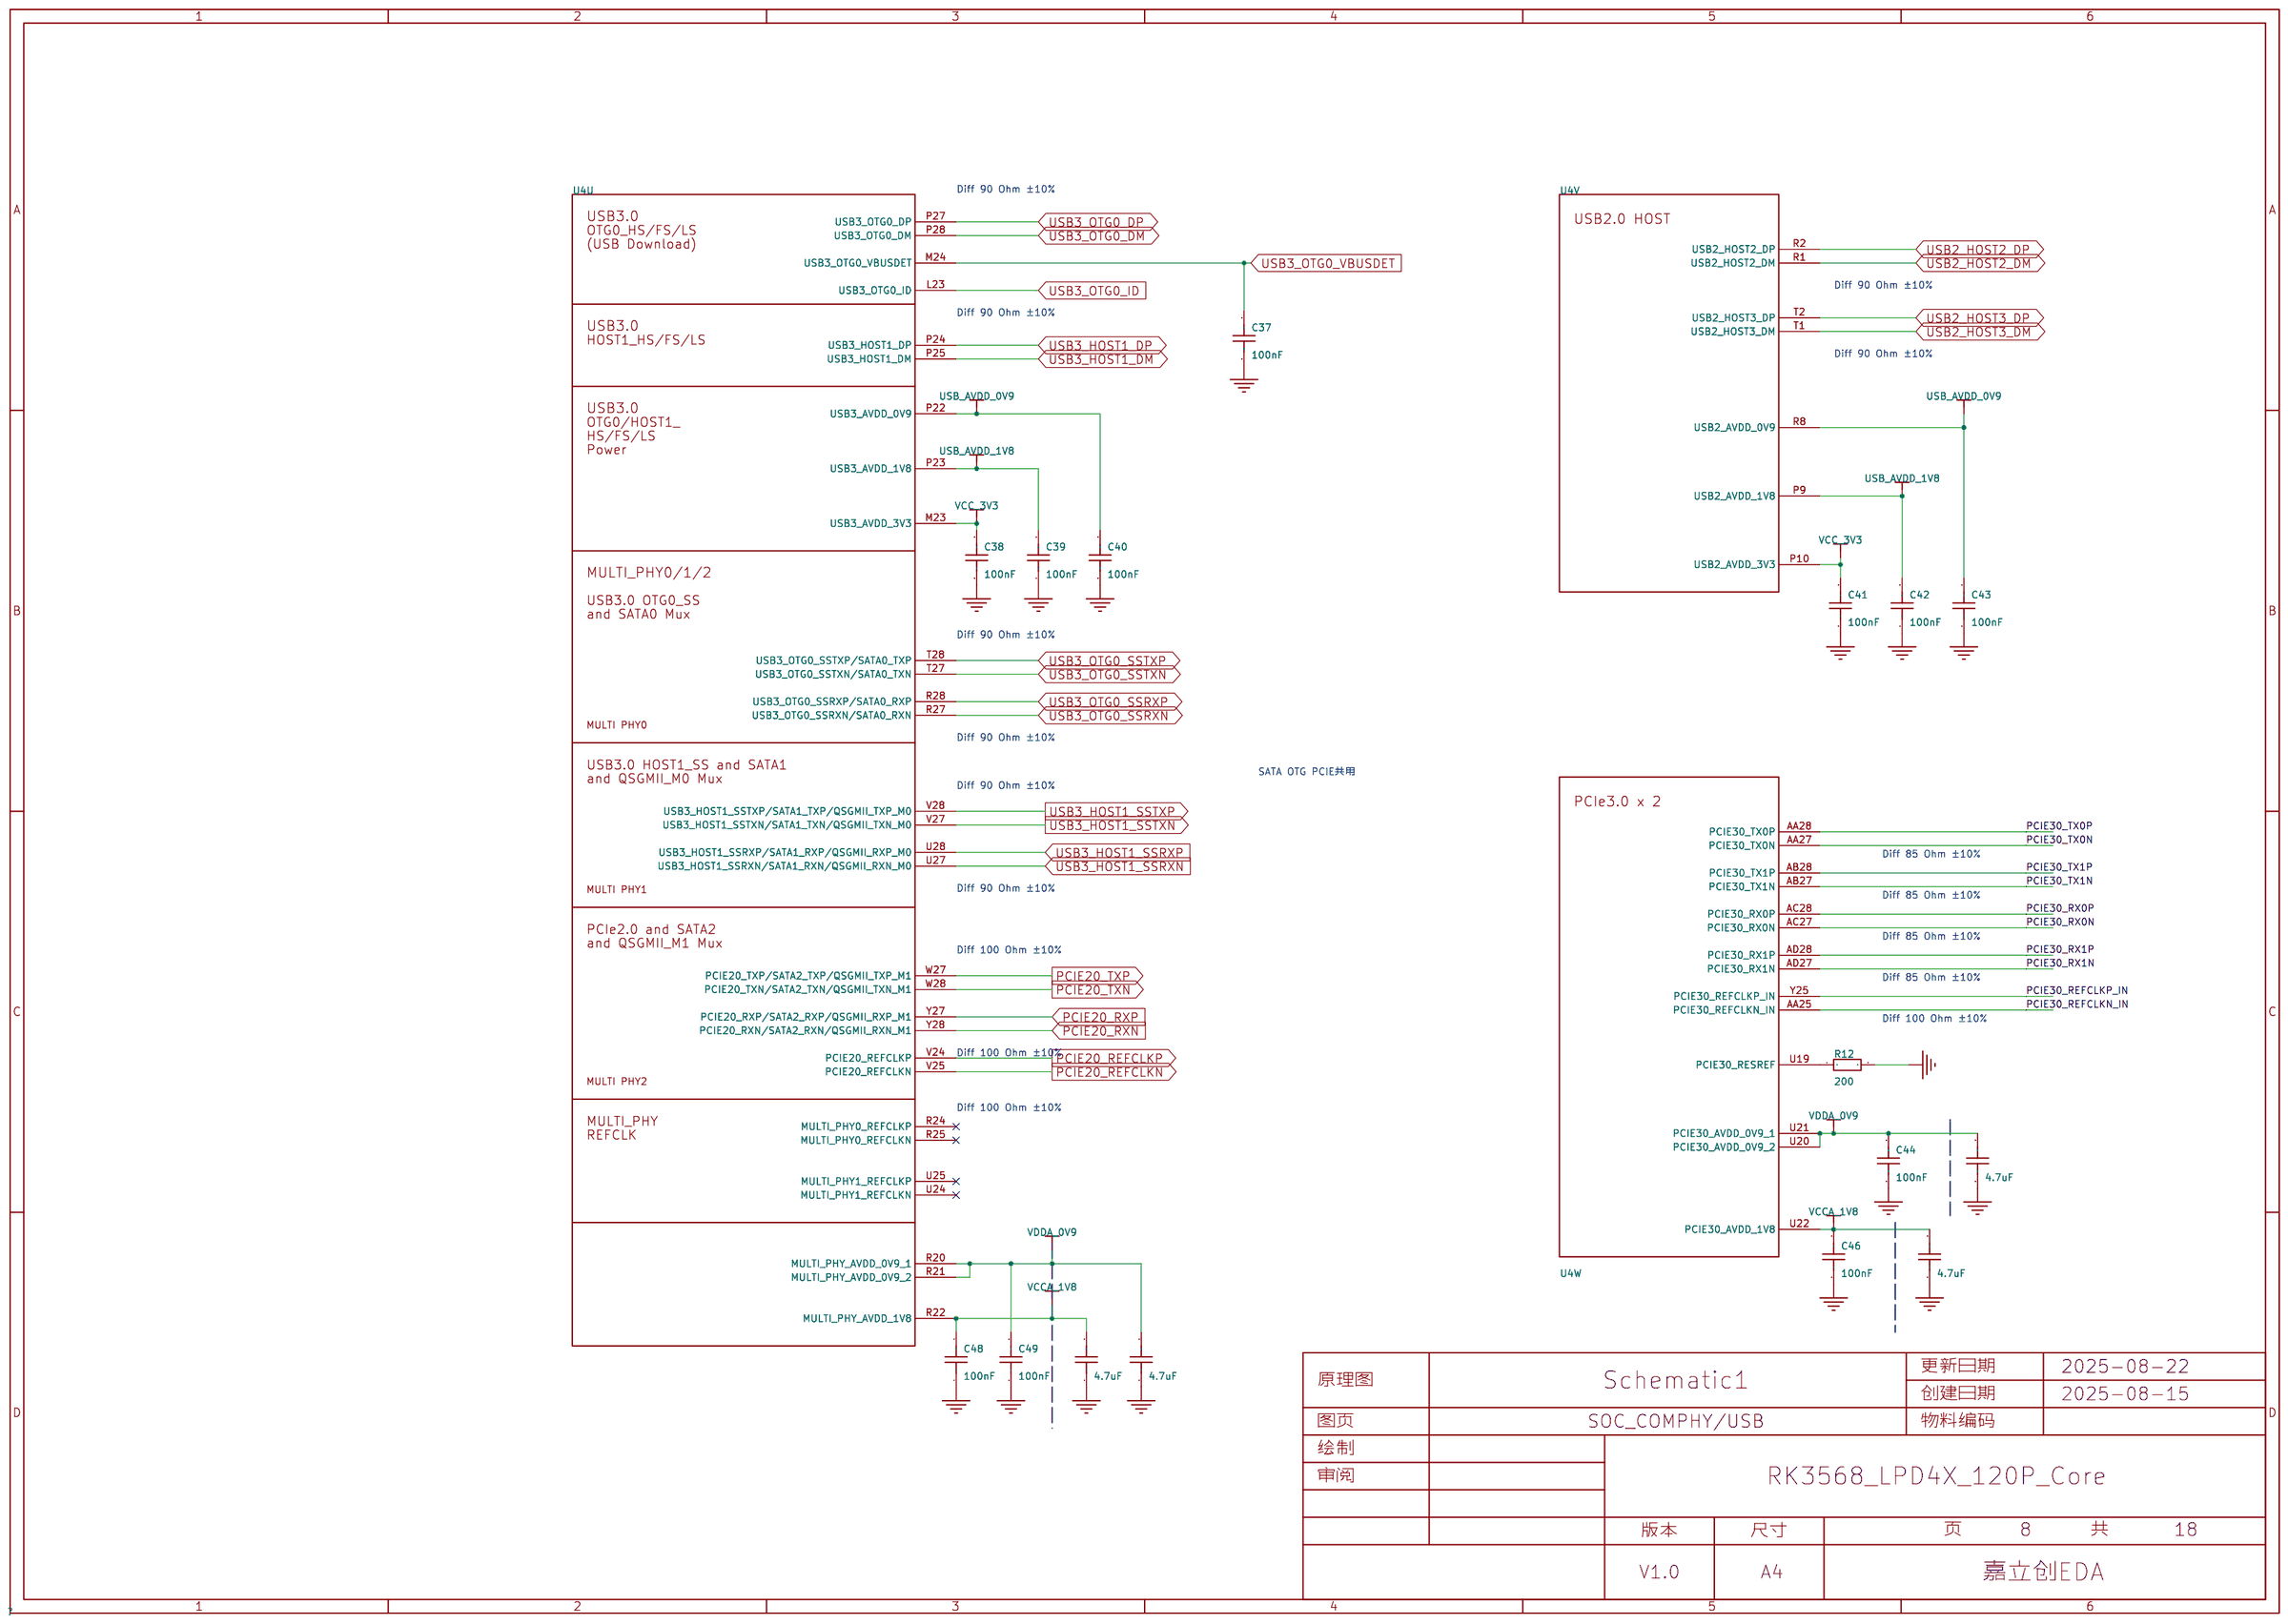
[diagram p21: SOC_COMPHY/USB]
23 SOC_PWR: Page Name: SOC_PWR
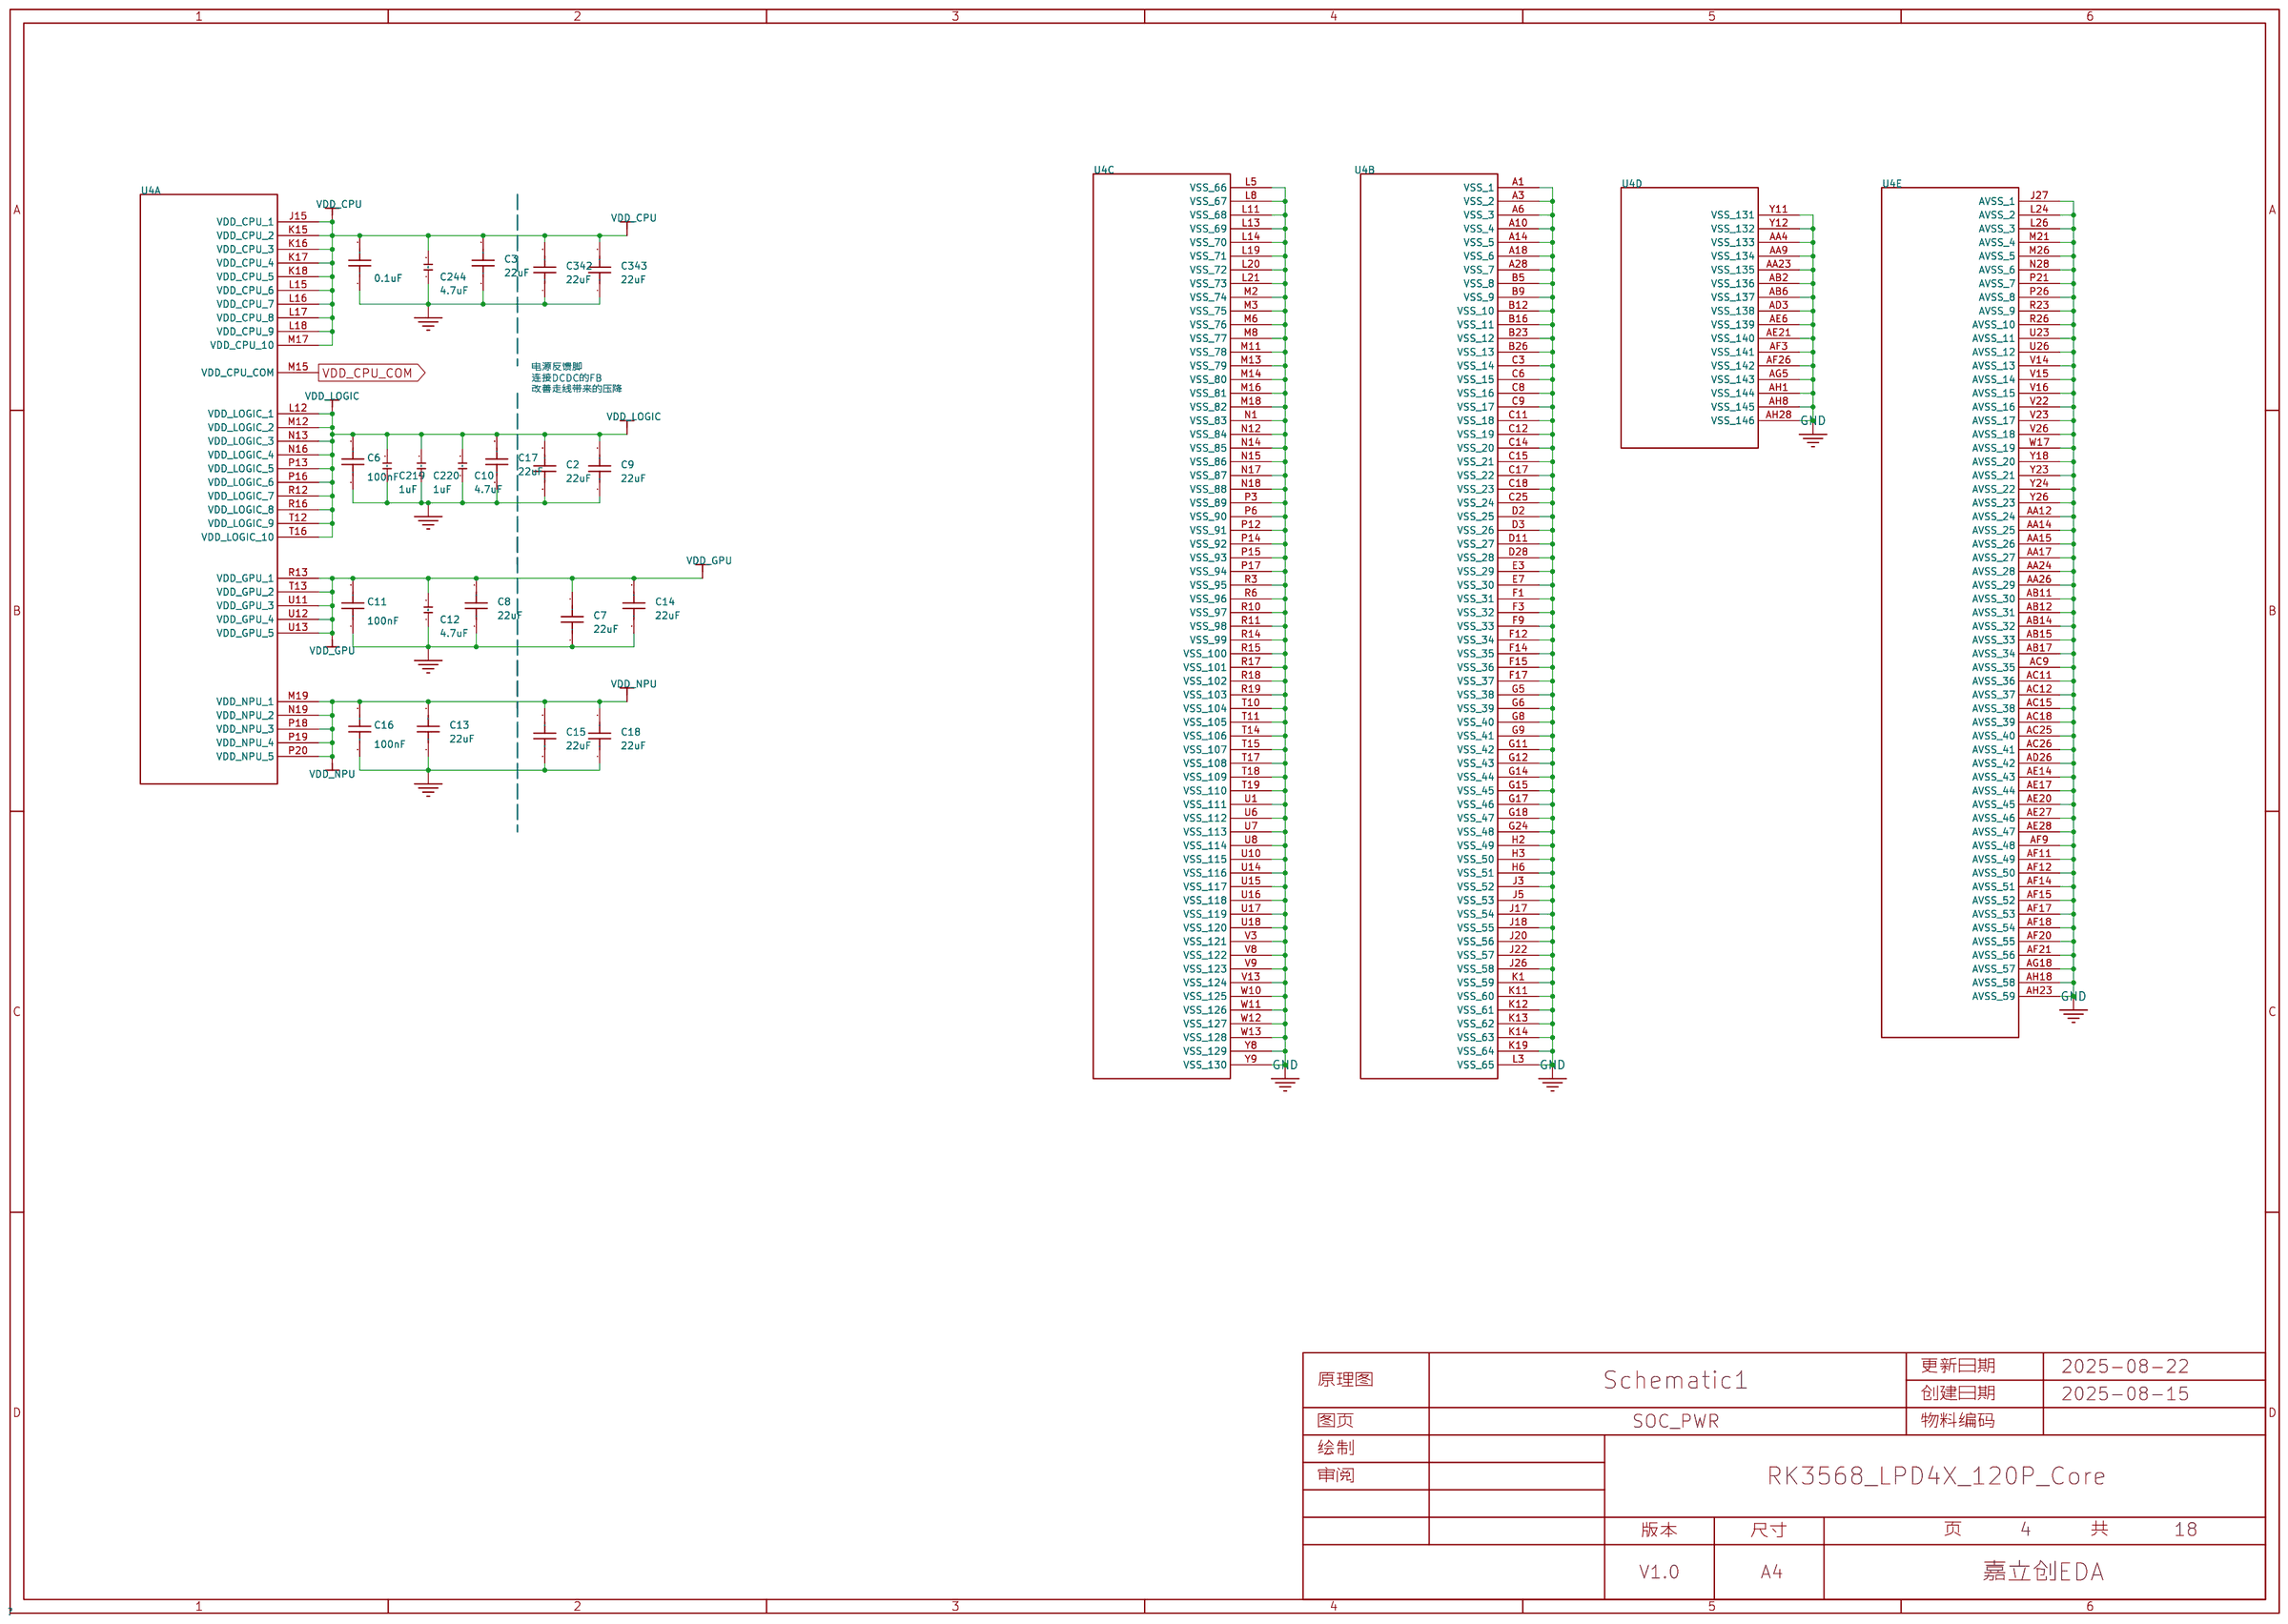
[diagram p22: SOC_PWR]
24 EMMC: Create Date: 2025-09-11; Page Name: EMMC; Project Name: RK3568B2地瓜派; Update Date: 2025-09-11
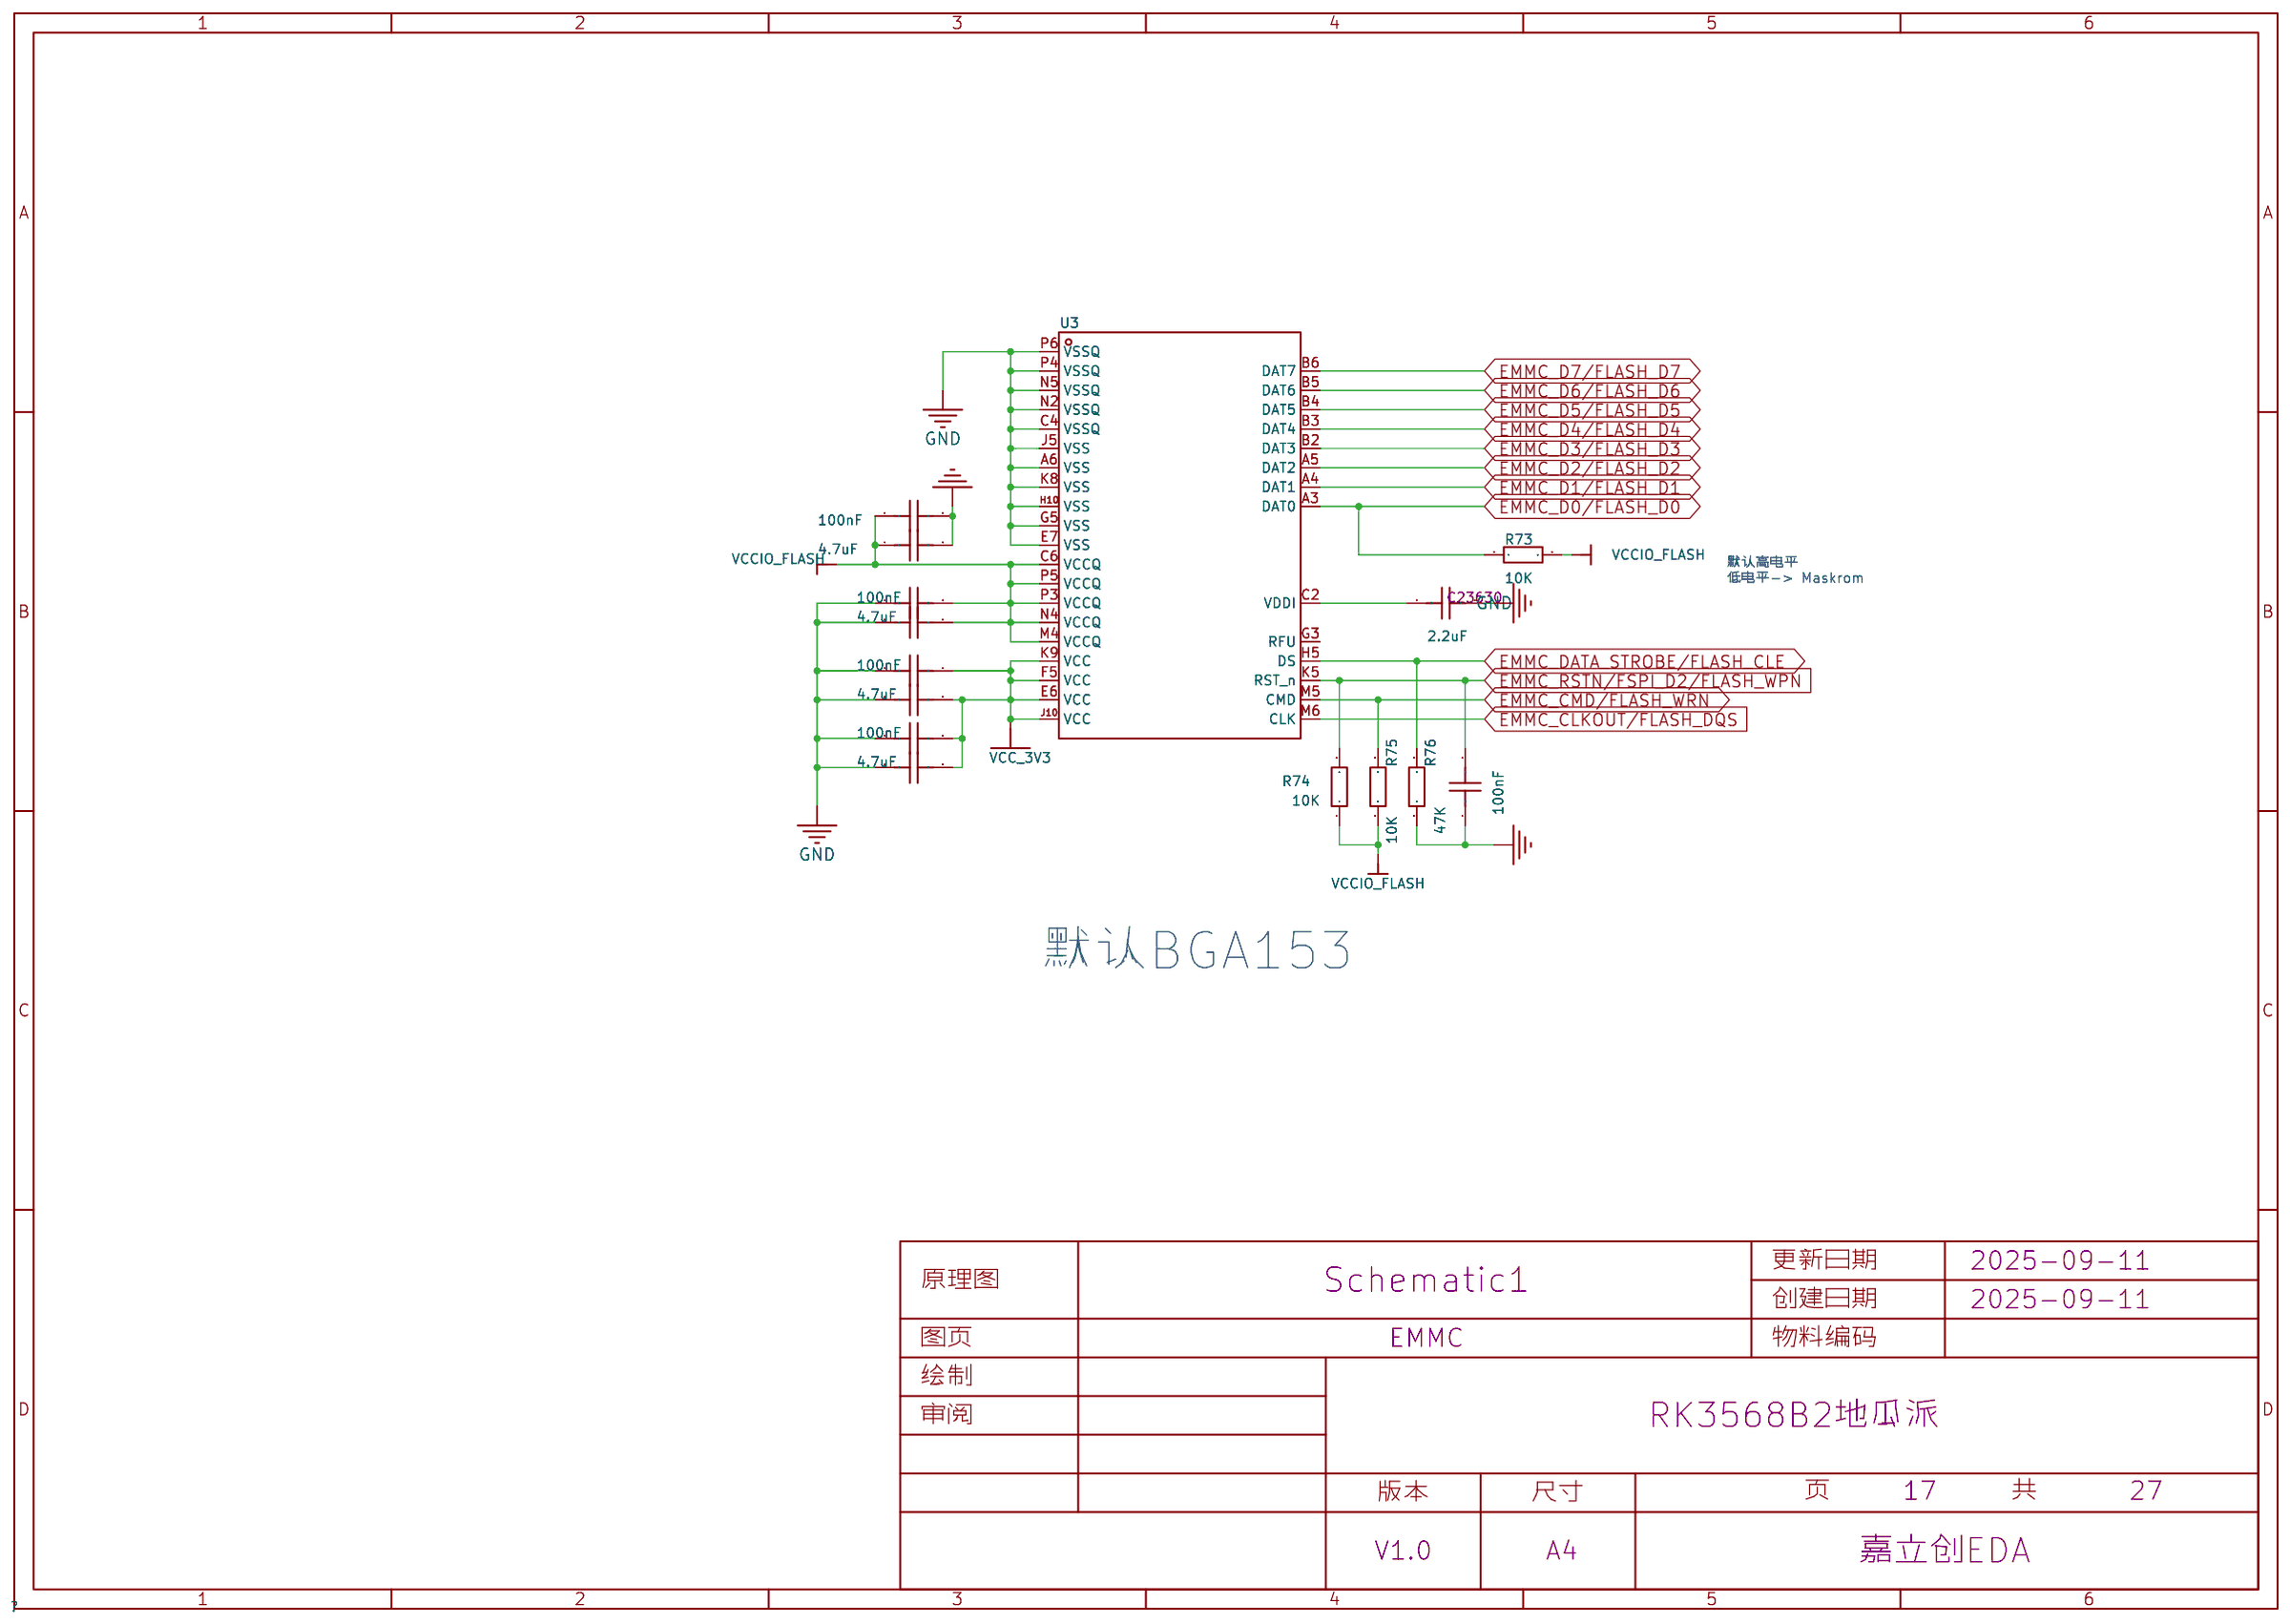
[diagram p23: EMMC]

## Parts
sheet AUDIO
C197  1uF  [R0402_1]
C198  220pF  [R0402_1]
CN3  PJ-313D  [AUDIO-SMD_PJ-313D-2]
MIC1  GMI4015P-2C-42db  [MIC-TH_BD4.0-P1.40-D0.4-L-FD]
R10  100  [R0402]
R43  2.2k  [R0402]
R379  0  [R0402]
R380  0  [R0402]
R381  0  [R0402]
U14  ESD5341N  [DFN1006-2L-BI_1]
U17  ZX-MX1.25-2PLT  [CONN-SMD_2P-P1.25-MX1.25-2P-LT]
U18  ESD5341N  [DFN1006-2L-BI_1]
U19  ESD5341N  [DFN1006-2L-BI_1]
U82  ESD5341N  [DFN1006-2L-BI_1]
U83  ESD5341N  [DFN1006-2L-BI_1]
U84  ESD5341N  [DFN1006-2L-BI_1]
sheet DISPLAY
C108  1uF  [c0402-nsk]
C234  4.7uF  [C0603]
C543  100nF  [C0603]
D32  SS34  [SMA_L4.3-W2.6-LS5.0-FD]
FPC1  HC-FPC-03-09-31RLTAG  [FPC-SMD_31P-P0.30_HC-FPC-03-09-31RLTAG]
FPC2  FPC-05F-6PH20  [FPC-SMD_6P-P0.50_XUNPU_FPC-05F-6PH20]
L16  10uH  [IND-SMD_L2.5-W2.0]
L24  BLM18PG121SN1D  [L0603_1]
R320  10K  [R0402]
R321  3.6R  [R0603]
R322  3.6R  [R0603]
U79  SY7201ABC  [SOT-23-6_L2.9-W1.6-P0.95-LS2.8-BR]
sheet EMMC
C184  100nF  [c0402-nsk]
C185  4.7uF  [c0402-nsk]
C186  100nF  [c0402-nsk]
C187  4.7uF  [c0402-nsk]
C188  2.2uF  [c0402-nsk]
C189  100nF  [c0402-nsk]
C190  4.7uF  [c0402-nsk]
C191  100nF  [c0402-nsk]
C192  4.7uF  [c0402-nsk]
C193  100nF  [c0402-nsk]
R73  10K  [R0402]
R74  10K  [R0402]
R75  10K  [R0402]
R76  47K  [R0402]
U3  -  [fbga-153_l13.0-w11.5-p0.50_klmag1jetd-b041]
sheet IO资源引出
H2  -  [HDR-TH_3P-P2.54-V-M]
R40  100  [R0402]
R41  100  [R0402]
U12  ESD5311X  [DFN1006-2L-BI]
U13  ESD5311X  [DFN1006-2L-BI]
U20  ZX-MX1.25-2PLT  [CONN-SMD_2P-P1.25-MX1.25-2P-LT]
sheet SOC_COMPHY/USB
C37  100nF  [C0201]
C38  100nF  [C0201]
C39  100nF  [C0201]
C40  100nF  [C0201]
C41  100nF  [C0201]
C42  100nF  [C0201]
C43  100nF  [C0201]
C44  100nF  [C0201]
C45  4.7uF  [c0402-nsk]
C46  100nF  [C0201]
C47  4.7uF  [c0402-nsk]
C48  100nF  [C0201]
C49  100nF  [C0201]
C50  4.7uF  [c0402-nsk]
C51  4.7uF  [c0402-nsk]
R12  200  [R0201]
sheet SOC_DDR
C19  100nF  [MYC0201]
C221  100nF  [MYC0201]
C222  4.7uF  [MYC0402]
C223  4.7uF  [MYC0402]
C224  10uF  [C0603]
C225  100nF  [MYC0201]
C226  100nF  [MYC0201]
C227  4.7uF  [MYC0402]
C228  4.7uF  [MYC0402]
C229  4.7uF  [MYC0402]
R8  120Ω  [r0402-nsk]
sheet SOC_DISPLAY
C58  100nF  [C0201]
C60  100nF  [C0201]
C61  1uF  [C0201]
C63  100nF  [C0201]
C64  100nF  [C0201]
C66  100nF  [C0201]
R9  2.2  [R0402]
R19  2.2  [R0402]
R21  2.2  [R0402]
R32  1.62K  [R0201]
R33  2.2  [R0402]
R34  2.2  [R0402]
R35  2.2  [R0402]
R36  2.2  [R0402]
R37  2.2  [R0402]
sheet SOC_IO
C70  100nF  [C0201]
C71  100nF  [C0201]
R171  10K  [R0402]
R173  2.2K  [R0402]
R174  2.2K  [R0402]
sheet SOC_MAC/SAR/I2S
C52  100nF  [C0201]
C53  100nF  [C0201]
C56  100nF  [C0201]
C57  100nF  [C0201]
C200  1nF  [c0402-nsk]
R11  4.7K  [R0402]  (no BOM)
R13  22  [R0402]
R14  22  [R0402]
R15  22  [R0402]
R16  22  [R0402]
R17  22  [R0402]
R20  22  [R0402]
R22  22  [R0402]
R23  10K  [R0402]
R47  100  [R0402]
RST2  -  [Key_SMD_4.2x3.2x2.5]
U11  ESD5451N  [X1-DFN1006-2_L1.0-W0.6-P0.65-BI]
sheet SOC_PWR
C1  0.1uF  [C0201]
C2  22uF  [C0603]
C3  22uF  [C0603]
C6  100nF  [C0201]
C7  22uF  [C0603]
C8  22uF  [C0603]
C9  22uF  [C0603]
C10  4.7uF  [MYC0402]
C11  100nF  [C0201]
C12  4.7uF  [MYC0402]
C13  22uF  [C0603]
C14  22uF  [C0603]
C15  22uF  [C0603]
C16  100nF  [C0201]
C17  22uF  [C0603]
C18  22uF  [C0603]
C219  1uF  [MYC0402]
C220  1uF  [MYC0402]
C244  4.7uF  [MYC0402]
C342  22uF  [C0603]
C343  22uF  [C0603]
U4  -  [BGA-636_L19.0-W19.0-P0.65-BL]  (sections A,B,C,D,E,F,G,H,I,J,K,L,M,N,O,P,Q,R,S,T,U,V,W)
sheet SOC_SOUND
C72  100nF  [C0201]
sheet WIFI
C211  10uF  [C0603]
C212  22uF  [C0603]
C214  22uF  [C0603]
C528  100nF  [c0402-nsk]
C530  2.7PF  [c0402-nsk]
RF1  6GHz  [IPEX-SMD_BWIPX-1-001E]
U69  -  [BL_M8800DU6_40L]

## Library data of the parts
C197 C198 = CL05A105KP5NNNC: 容值:1uF;精度:±10%;额定电压:10V;材质(温度系数):X5R;; LCSC Part Name: 1uF ±10% 10V; Supplier Part: C14445; Manufacturer: SAMSUNG(三星); Supplier Footprint: 0402; JLCPCB Part Class: 扩展库; Datasheet: https://atta.szlcsc.com/upload/public/pdf/source/20160103/1457707670698.pdf; Supplier: LCSC; Tolerance: ±10%; Voltage Rated: 10V; Temperature Coefficient: X5R
CN3 = PJ-313D_C668608: 连接器类型:3.5mm耳机座;额定电流:500mA;额定电压:30V;触头材质:铜;触头镀层:银;工作温度范围:-30℃~+70℃;; LCSC Part Name: 3.5mm耳机座; Supplier Part: C668608; Manufacturer: SHOU HAN(首韩); Supplier Footprint: SMD; JLCPCB Part Class: 扩展库; Datasheet: https://atta.szlcsc.com/upload/public/pdf/source/20200618/C668608_AB2020DBBA26E8897834D328F2FA3C40.pdf; Supplier: LCSC; Connector Type: 3.5mm耳机座; Current Rating (Max): 500mA; Voltage Rating (Max): 30V; Contact Material: 铜; Contact Plating: 银; Operating Temperature Range: -30℃~+70℃
MIC1 = GMI4015P-2C-42db: LCSC Part Name: 全指向双电容φ4.0*1.5mm 1.5V-10V 灵敏度-42dB 低阻抗; Supplier Part: C233292; Manufacturer: INGHAi(赢海); Supplier Footprint: 插件,D=4mm; JLCPCB Part Class: Extended Part; Datasheet: https://item.szlcsc.com/datasheet/GMI4015P-2C-42db/233591.html; Supplier: LCSC
R9-R11 R13-R17 R19-R23 R33-R37 R40 R41 R43 R47 R73-R76 R171 R173 R174 R320 R379-R381 = Res_0402: Supplier Footprint: 0402
U14 U18 U19 U82-U84 = ESD5341N_C20612964: LCSC Part Name: ESD静电保护管; Supplier Part: C20612964; Manufacturer: KUU; Supplier Footprint: DFN1006-2L; JLCPCB Part Class: 扩展库; Datasheet: https://atta.szlcsc.com/upload/public/pdf/source/20240126/9EE8C033ACD76A81C21292FAA1DFE4C1.pdf; Supplier: LCSC
U17 U20 = ZX-MX1.25-2PLT: 插针结构:1x2P;间距:1.25mm;安装方式:立贴;参考系列:PicoBlade(MX 1.25);总PIN数:2P;排数:1;每排PIN数:2;行距:-;额定电流:1A;触头材质:黄铜;触头镀层:锡;工作温度:-25℃~+85℃;; LCSC Part Name: 1x2P 间距:1.25mm 立贴 系列:PicoBlade(MX 1.25); Supplier Part: C7430473; Manufacturer: Megastar(兆星); Supplier Footprint: SMD,P=1.25mm; JLCPCB Part Class: Extended Part; Datasheet: https://item.szlcsc.com/datasheet/ZX-MX1.25-2PLT/8430342.html; Supplier: LCSC; Pins Structure: 1x2P; Pitch: 1.25mm; Mounting Type: 立贴; Reference Series: PicoBlade(MX 1.25); Number of Pins: 2P; Number of Rows: 1; Number of PINs Per Row: 2; Current Rating: 1A; Contact Material: 黄铜; Contact Plating: 锡; Operating Temperature: -25℃~+85℃; Voltage Rating: 125V; Plastic Material: LCP; Supplementary Features: 辅助焊脚; Color: 米色; Z-Height of the Board: 4.7mm; X-Length of Bottom Edge on Board (Spacing Line): 7.5mm; Y-Width of Bottom Edge on Board: 4.3mm
C108 C184 C186 C189 C191 = CC0603KRX7R9BB104: 容值:100nF;精度:±10%;额定电压:50V;材质(温度系数):X7R;; LCSC Part Name: 100nF ±10% 50V; Supplier Part: C14663; Manufacturer: YAGEO(国巨); Supplier Footprint: 0603; JLCPCB Part Class: Basic Part; Datasheet: https://atta.szlcsc.com/upload/public/pdf/source/20180910/C282072_33301C7F631E79921B82A8DAC6BCC5B3.pdf; Supplier: LCSC; Tolerance: ±10%; Voltage Rated: 50V; Temperature Coefficient: X7R
C2 C3 C7-C9 C13-C15 C17 C18 C211 C212 C214 C224 C234 C342 C343 C543 = CAP_0603: Supplier Footprint: 0603
D32 = SS34_C7420365: 二极管配置:独立式;正向压降(Vf):550mV@3.0A;直流反向耐压(Vr):40V;平均整流电流(Io):3A;; LCSC Part Name: 电压:40V 电流:3A; Supplier Part: C7420365; Manufacturer: 宏迦橙; Supplier Footprint: SMA(DO-214AC); JLCPCB Part Class: 扩展库; Datasheet: https://atta.szlcsc.com/upload/public/pdf/source/20230828/75438452AEE6C276EDA92B2AF599BE05.pdf; Supplier: LCSC; Diode Configuration: 独立式; Forward Voltage (Vf@If): 550mV@3.0A; Reverse Voltage (Vr): 40V; Average Rectified Current (Io): 3A; Reverse Leakage Current (Ir): 200uA@40V; Peak forward surge current: 80A; Voltage - Forward(Vf@If): 550mV@3.0A; Voltage - DC Reverse(Vr): 40V; Current - Rectified: 3A
FPC1 = HC-FPC-03-09-31RLTAG: 锁定特性:翻盖式;触点类型:下接;触点数量:31P;间距:0.3mm;安装方式:卧贴;工作温度:-55℃~+85℃;; LCSC Part Name: 翻盖式 下接 P数:31P 间距:0.3mm; Supplier Part: C5213720; Manufacturer: HCTL(华灿天禄); Supplier Footprint: SMD,P=0.3mm,卧贴; JLCPCB Part Class: 扩展库; Datasheet: https://item.szlcsc.com/datasheet/HC-FPC-03-09-31RLTAG/5909012.html; Supplier: LCSC; Locking Feature: 翻盖式; Contact Type: 下接; Number of Contacts: 31P; Pitch: 0.3mm; Mounting Type: 卧贴; FFC, FCB Thickness: 0.2mm; Height Above Board: 1mm; Contact Material: 磷青铜; Operating Temperature: -55℃~+85℃
FPC2 = FPC-05F-6PH20: 锁定特性:翻盖式;触点类型:下接;触点数量:6P;间距:0.5mm;安装类型:卧贴;工作温度范围:-25℃~+85℃;; LCSC Part Name: 间距:0.5mm P数:6P 翻盖式 下接; Supplier Part: C2856796; Manufacturer: XUNPU(讯普); Supplier Footprint: SMD,P=0.5mm,卧贴; JLCPCB Part Class: 扩展库; Datasheet: https://atta.szlcsc.com/upload/public/pdf/source/20210922/16B003FB53336DDF6538142CC465AC4D.pdf; Supplier: LCSC; Locking Feature: 翻盖式; Contact Type: 下接; Number of Contacts: 6P; Pitch: 0.5mm; Mounting Type: 卧贴; FFC, FCB Thickness: 0.3mm; Height Above Board: 2mm; Operating Temperature Range: -25℃~+85℃
L16 = FTC252012S100MBCA: 电感值:10uH;精度:±20%;额定电流:1.2A;饱和电流(Isat):1.6A;类型:一体成型电感;; LCSC Part Name: 10uH ±20% 1.6A; Supplier Part: C5832376; Manufacturer: cjiang(长江微电); Supplier Footprint: SMD,2x2.5mm; JLCPCB Part Class: 扩展库; Datasheet: https://atta.szlcsc.com/upload/public/pdf/source/20230602/8FFEDA9C0247A92A0D4B67554BFE4091.pdf; Supplier: LCSC; Tolerance: ±20%; Rated Current: 1.2A; Saturation Current (Isat): 1.6A; DC Resistance (DCR): 330mΩ; Type: 一体成型电感
L24 = BLM18PG121SN1D: 标称阻抗@测试频率:120Ω@100MHz;误差:±25%;直流电阻(RDC):50mΩ;; LCSC Part Name: 单路 0603磁珠 阻抗120Ω@100MHz; Supplier Part: C14709; Manufacturer: muRata(村田); Supplier Footprint: 0603; JLCPCB Part Class: 基础库; Datasheet: https://atta.szlcsc.com/upload/public/pdf/source/20130704/1457706621422.pdf; Supplier: LCSC; Impedance @ Frequency: 120Ω@100MHz; Tolerance: ±25%; DC Resistance: 50mΩ; Current Rating: 2A; Circuits: 1; DC Resistance(DCR): 50mΩ; Number of Circuits: 1; Operating Temperature: -55℃~+125℃
R321 R322 = Res_0603: Supplier Footprint: 0603
U79 = SY7201ABC: 拓扑结构:升压;; Supplier Part: C82173; Manufacturer: Silergy(矽力杰); Supplier Footprint: SOT-23-6; JLCPCB Part Class: 扩展库; Datasheet: https://atta.szlcsc.com/upload/public/pdf/source/20160903/1472896628181.pdf; Supplier: LCSC; Topology: 升压
C185 C187 C190 C192 C193 = CL10A475KO8NNNC: 容值:4.7uF;精度:±10%;额定电压:16V;材质(温度系数):X5R;; LCSC Part Name: 4.7uF ±10% 16V; Supplier Part: C19666; Manufacturer: SAMSUNG(三星); Supplier Footprint: 0603; JLCPCB Part Class: Basic Part; Datasheet: https://atta.szlcsc.com/upload/public/pdf/source/20160103/1457707703134.pdf; Supplier: LCSC; Tolerance: ±10%; Voltage Rated: 16V; Temperature Coefficient: X5R
C188 = CL10A225KO8NNNC: 容值:2.2uF;精度:±10%;额定电压:16V;材质(温度系数):X5R;; LCSC Part Name: 2.2uF ±10% 16V; Supplier Part: C23630; Manufacturer: SAMSUNG(三星); Supplier Footprint: 0603; JLCPCB Part Class: Basic Part; Datasheet: https://atta.szlcsc.com/upload/public/pdf/source/20160103/1457707709512.pdf; Supplier: LCSC; Tolerance: ±10%; Voltage Rated: 16V; Temperature Coefficient: X5R
U3 = EMMC BGA153: Pin Type: IN; Supplier: LCSC; Supplier Part: C577446; Manufacturer: Kingston(金士顿); Manufacturer Part: EMMC04G-M627-A01
H2 = HDR-M_2.54_1x3P: Supplier Part: C2937625; Supplier Footprint: 插件
U12 U13 = ESD5311X_C2844730: 极性:双向;反向截止电压(Vrwm):5V;最大钳位电压:21V;峰值脉冲电流(Ipp):4A;峰值脉冲功率(Ppp):80W;击穿电压:7.5V;; Supplier Part: C2844730; Manufacturer: TECH PUBLIC(台舟); Supplier Footprint: DFN1006-2; JLCPCB Part Class: 扩展库; Datasheet: https://atta.szlcsc.com/upload/public/pdf/source/20210709/C2844730_C8067B3CCE558E7D499244211FB5DC21.pdf; Supplier: LCSC; polarity: 双向; Reverse Stand-Off Voltage (Vrwm): 5V; Maximum Clamping Voltage: 21V; Peak Pulse Current (Ipp): 4A; Peak Pulse Power Dissipation (Ppp): 80W; Breakdown Voltage: 7.5V; Reverse Leakage Current (Ir): 80nA; Number of Lines: 单路; Operating Temperature: -55℃~+125℃; level of protection: IEC 61000-4-2; Type: ESD
C1 C6 C11 C16 C37-C44 C46 C48 C49 C52 C53 C56-C58 C60 C61 C63 C64 C66 C70-C72 = GRM035R60J475ME15D: 容值:4.7uF;精度:±20%;额定电压:6.3V;温度系数:X5R;; LCSC Part Name: 4.7uF ±20% 6.3V; Supplier Part: C335103; Manufacturer: muRata(村田); Supplier Footprint: 0201; JLCPCB Part Class: Extended Part; Datasheet: https://item.szlcsc.com/datasheet/GRM035R60J475ME15D/313624.html; Supplier: LCSC; Tolerance: ±20%; Voltage Rating: 6.3V; Temperature Coefficient: X5R
C45 C47 C50 C51 = CL10A105KB8NNNC: 容值:1uF;精度:±10%;额定电压:50V;材质(温度系数):X5R;; LCSC Part Name: 1uF ±10% 50V; Supplier Part: C15849; Manufacturer: SAMSUNG(三星); Supplier Footprint: 0603; JLCPCB Part Class: Basic Part; Datasheet: https://atta.szlcsc.com/upload/public/pdf/source/20160103/1457707679084.pdf; Supplier: LCSC; Tolerance: ±10%; Voltage Rated: 50V; Temperature Coefficient: X5R
R12 R32 = Res_0201: Supplier Footprint: 0201
C19 C221 C225 C226 = MY_C0201: my0201
C10 C12 C219 C220 C222 C223 C227-C229 C244 = MYC0402: C0402电容
R8 = 0402WGF1200TCE: 电阻类型:厚膜电阻;阻值:120Ω;精度:±1%;功率:62.5mW;温度系数:±100ppm/℃;; LCSC Part Name: 厚膜电阻 120Ω ±1% 62.5mW; Supplier Part: C25079; Manufacturer: UNI-ROYAL(厚声); Supplier Footprint: 0402; JLCPCB Part Class: Basic Part; Datasheet: https://atta.szlcsc.com/upload/public/pdf/source/20200306/C422600_1E6D84923E4A46A82E41ADD87F860B5C.pdf; Supplier: LCSC; Type: 厚膜电阻; Tolerance: ±1%; Power(Watts): 62.5mW; Temperature Coefficient: ±100ppm/℃; Overload Voltage (Max): 50V; Operating Temperature Range: -55℃~+155℃
C200 = CL10A105KB8NNNC: 容值:1uF;精度:±10%;额定电压:50V;材质(温度系数):X5R;; LCSC Part Name: 1uF ±10% 50V; Supplier Part: C15849; Manufacturer: SAMSUNG(三星); Supplier Footprint: 0603; JLCPCB Part Class: Basic Part; Datasheet: https://atta.szlcsc.com/upload/public/pdf/source/20160103/1457707679084.pdf; Supplier: LCSC; Tolerance: ±10%; Voltage Rated: 50V; Temperature Coefficient: X5R; Comment: DNP
RST2 = Key_SMD_4.2x3.2x2.5: Supplier Footprint: SMD
U11 = ESD5451N_C2936977: 极性:双向;反向截止电压(Vrwm):5V;钳位电压:13V;峰值脉冲电流(Ipp):5.5A;峰值脉冲功率(Ppp):90W;击穿电压:8.4V;; LCSC Part Name: ESD二极管; Supplier Part: C2936977; Manufacturer: TECH PUBLIC(台舟); Supplier Footprint: DFN1006-2; JLCPCB Part Class: 扩展库; Datasheet: https://item.szlcsc.com/datasheet/ESD5451N/3290324.html; Supplier: LCSC; Polarity: 双向; Reverse Stand-Off Voltage (Vrwm): 5V; Clamping Voltage: 13V; Peak Pulse Current (Ipp): 5.5A; Peak Pulse Power Dissipation (Ppp): 90W; Voltage - Breakdown: 8.4V; Reverse Leakage Current (Ir): 80nA; Number of Channels: 单路; Operating Temperature: -55℃~+125℃; level of protection: IEC 61000-4-2; Type: ESD
U4 = RK3568
C528 C530 = CAP_0402: Supplier Footprint: 0402
RF1 = BWIPX-1-001E: 连接器类型:板端;接口类型:内针;端口数量:1;接口直径:-;接口长度/高度:-;频率:6GHz;射频系列:IPEX;阻抗:50Ω;样式:-;工作温度:-;; LCSC Part Name: IPEX 内针; Supplier Part: C496552; Manufacturer: BAT WIRELESS(蝙蝠无线); Supplier Footprint: SMD; JLCPCB Part Class: 扩展库; Datasheet: https://item.szlcsc.com/datasheet/BWIPX-1-001E/508501.html; Supplier: LCSC; Connector Type: 板端; Interface: 内针; Number of Ports: 1; RF Series: IPEX; Impedance: 50Ω
U69 = BL_M8800DU6_40L: AIC8800D40L双频5G无线模块wifi6+BLE蓝牙配网IPC摄像头投屏图传

## Nets
GND: C1.1 C2.1 C3.1 C6.1 C7.1 C8.1 C9.1 C10.1 C11.1 C12.1 C13.1 C14.1 C15.1 C16.1 C17.1 C18.1 C19.1 C37.1 C38.1 C39.1 C40.1 C41.1 C42.1 C43.1 C44.1 C45.1 C46.1 C47.1 C48.1 C49.1 C50.1 C51.1 C52.1 C53.1 C56.1 C57.1 C58.1 C60.1 C61.1 C63.1 C64.1 C66.1 C70.1 C71.1 C72.1 C108.1 C184.2 C185.2 C186.1 C187.1 C188.1 C189.1 C190.1 C191.1 C192.1 C193.1 C197.2 C198.2 C200.2 C211.1 C212.1 C214.1 C219.1 C220.1 C221.1 C222.1 C223.1 C224.1 C225.1 C226.1 C227.1 C228.1 C229.1 C234.1 C244.1 C342.1 C343.1 C528.2 C543.1 FPC1.9 FPC1.10 FPC1.13 FPC1.16 FPC1.19 FPC1.22 FPC1.25 FPC1.28 FPC1.32 FPC1.33 FPC2.6 FPC2.7 FPC2.8 H2.1 MIC1.2 R11.1 R12.2 R32.2 R76.1 R320.1 R321.1 R322.1 RF1.2(GND) RF1.3(GND) RST2.3 RST2.4 U3.A6(VSS) U3.C4(VSSQ) U3.E7(VSS) U3.G5(VSS) U3.H10(VSS) U3.J5(VSS) U3.K8(VSS) U3.N2(VSSQ) U3.N5(VSSQ) U3.P4(VSSQ) U3.P6(VSSQ) U4.A1(VSS_1) U4.A3(VSS_2) U4.A6(VSS_3) U4.A10(VSS_4) U4.A14(VSS_5) U4.A18(VSS_6) U4.A28(VSS_7) U4.AA4(VSS_133) U4.AA9(VSS_134) U4.AA12(AVSS_24) U4.AA14(AVSS_25) U4.AA15(AVSS_26) U4.AA17(AVSS_27) U4.AA23(VSS_135) U4.AA24(AVSS_28) U4.AA26(AVSS_29) U4.AB2(VSS_136) U4.AB6(VSS_137) U4.AB11(AVSS_30) U4.AB12(AVSS_31) U4.AB14(AVSS_32) U4.AB15(AVSS_33) U4.AB17(AVSS_34) U4.AC9(AVSS_35) U4.AC11(AVSS_36) U4.AC12(AVSS_37) U4.AC15(AVSS_38) U4.AC18(AVSS_39) U4.AC25(AVSS_40) U4.AC26(AVSS_41) U4.AD3(VSS_138) U4.AD26(AVSS_42) U4.AE6(VSS_139) U4.AE14(AVSS_43) U4.AE17(AVSS_44) U4.AE20(AVSS_45) U4.AE21(VSS_140) U4.AE27(AVSS_46) U4.AE28(AVSS_47) U4.AF3(VSS_141) U4.AF9(AVSS_48) U4.AF11(AVSS_49) U4.AF12(AVSS_50) U4.AF14(AVSS_51) U4.AF15(AVSS_52) U4.AF17(AVSS_53) U4.AF18(AVSS_54) U4.AF20(AVSS_55) U4.AF21(AVSS_56) U4.AF26(VSS_142) U4.AG5(VSS_143) U4.AG18(AVSS_57) U4.AH1(VSS_144) U4.AH8(VSS_145) U4.AH18(AVSS_58) U4.AH23(AVSS_59) U4.AH28(VSS_146) U4.B5(VSS_8) U4.B9(VSS_9) U4.B12(VSS_10) U4.B16(VSS_11) U4.B23(VSS_12) U4.B26(VSS_13) U4.C3(VSS_14) U4.C6(VSS_15) U4.C8(VSS_16) U4.C9(VSS_17) U4.C11(VSS_18) U4.C12(VSS_19) U4.C14(VSS_20) U4.C15(VSS_21) U4.C17(VSS_22) U4.C18(VSS_23) U4.C25(VSS_24) U4.D2(VSS_25) U4.D3(VSS_26) U4.D11(VSS_27) U4.D28(VSS_28) U4.E3(VSS_29) U4.E7(VSS_30) U4.F1(VSS_31) U4.F3(VSS_32) U4.F9(VSS_33) U4.F12(VSS_34) U4.F14(VSS_35) U4.F15(VSS_36) U4.F17(VSS_37) U4.G5(VSS_38) U4.G6(VSS_39) U4.G8(VSS_40) U4.G9(VSS_41) U4.G11(VSS_42) U4.G12(VSS_43) U4.G14(VSS_44) U4.G15(VSS_45) U4.G17(VSS_46) U4.G18(VSS_47) U4.G24(VSS_48) U4.H2(VSS_49) U4.H3(VSS_50) U4.H6(VSS_51) U4.J3(VSS_52) U4.J5(VSS_53) U4.J8(DDR_AVSS) U4.J17(VSS_54) U4.J18(VSS_55) U4.J20(VSS_56) U4.J22(VSS_57) U4.J26(VSS_58) U4.J27(AVSS_1) U4.K1(VSS_59) U4.K11(VSS_60) U4.K12(VSS_61) U4.K13(VSS_62) U4.K14(VSS_63) U4.K19(VSS_64) U4.L3(VSS_65) U4.L5(VSS_66) U4.L8(VSS_67) U4.L11(VSS_68) U4.L13(VSS_69) U4.L14(VSS_70) U4.L19(VSS_71) U4.L20(VSS_72) U4.L21(VSS_73) U4.L24(AVSS_2) U4.L26(AVSS_3) U4.M2(VSS_74) U4.M3(VSS_75) U4.M6(VSS_76) U4.M8(VSS_77) U4.M11(VSS_78) U4.M13(VSS_79) U4.M14(VSS_80) U4.M16(VSS_81) U4.M18(VSS_82) U4.M20(EDP_TX_AVDD_0V9) U4.M21(AVSS_4) U4.M22(EDP_TX_AVDD_1V8) U4.M26(AVSS_5) U4.N1(VSS_83) U4.N12(VSS_84) U4.N14(VSS_85) U4.N15(VSS_86) U4.N17(VSS_87) U4.N18(VSS_88) U4.N28(AVSS_6) U4.P3(VSS_89) U4.P6(VSS_90) U4.P12(VSS_91) U4.P14(VSS_92) U4.P15(VSS_93) U4.P17(VSS_94) U4.P21(AVSS_7) U4.P26(AVSS_8) U4.R3(VSS_95) U4.R6(VSS_96) U4.R10(VSS_97) U4.R11(VSS_98) U4.R14(VSS_99) U4.R15(VSS_100) U4.R17(VSS_101) U4.R18(VSS_102) U4.R19(VSS_103) U4.R23(AVSS_9) U4.R26(AVSS_10) U4.T10(VSS_104) U4.T11(VSS_105) U4.T14(VSS_106) U4.T15(VSS_107) U4.T17(VSS_108) U4.T18(VSS_109) U4.T19(VSS_110) U4.U1(VSS_111) U4.U6(VSS_112) U4.U7(VSS_113) U4.U8(VSS_114) U4.U10(VSS_115) U4.U14(VSS_116) U4.U15(VSS_117) U4.U16(VSS_118) U4.U17(VSS_119) U4.U18(VSS_120) U4.U23(AVSS_11) U4.U26(AVSS_12) U4.V3(VSS_121) U4.V8(VSS_122) U4.V9(VSS_123) U4.V13(VSS_124) U4.V14(AVSS_13) U4.V15(AVSS_14) U4.V16(AVSS_15) U4.V22(AVSS_16) U4.V23(AVSS_17) U4.V26(AVSS_18) U4.W10(VSS_125) U4.W11(VSS_126) U4.W12(VSS_127) U4.W13(VSS_128) U4.W15(MIPI_DSI_TX1_AVDD_0V9) U4.W17(AVSS_19) U4.Y8(VSS_129) U4.Y9(VSS_130) U4.Y11(VSS_131) U4.Y12(VSS_132) U4.Y15(MIPI_DSI_TX1_AVDD_1V8) U4.Y18(AVSS_20) U4.Y23(AVSS_21) U4.Y24(AVSS_22) U4.Y26(AVSS_23) U11.2 U12.2 U13.2 U14.1 U17.3 U17.4 U18.1 U19.1 U20.2 U20.3 U20.4 U69.1(RF_GND) U69.6(GND) U69.7(FR_GND) U69.8(GND) U79.2(GND) U82.1 U83.1 U84.1 ; also on sheet 1 4 5 6 7 8 9 10 11 12 25 26 27
VCC0V6_DDR: C225.2 C226.2 C227.2 C228.2 C229.2 U4.J11(DDRPHY_VDDQL_1) U4.J12(DDRPHY_VDDQL_2) U4.J14(DDRPHY_VDDQL_3) U4.K10(DDRPHY_VDDQL_4) U4.L10(DDRPHY_VDDQL_5) U4.M10(DDRPHY_VDDQL_6) ; also on sheet 6 26
VCC3V3_SYS: C211.2 C212.2 C214.2 C528.1 L24.1 U69.3(VDD33) ; also on sheet 4 11 25 26 27
VCC-5V: C234.2 L16.2 U20.1 U79.6(IN) ; also on sheet 8 9 10 25 26
VCC_1V8: C57.2 C70.2 FPC1.29 R173.2 R174.2 U4.H20(OTP_VCC18) U4.R9(VCCIO6_1) U4.U9(VCCIO6_2) ; also on sheet 25 26 27
VCC_3V3: C38.2 C41.2 C52.2 C71.2 C189.2 C190.2 C191.2 C192.2 FPC2.1 R171.2 U3.E6(VCC) U3.F5(VCC) U3.J10(VCC) U3.K9(VCC) U4.M23(USB3_AVDD_3V3) U4.P10(USB2_AVDD_3V3) U4.V10(VCCIO5_1) U4.V11(VCCIO5_2) U4.V12(VCCIO7) ; also on sheet 9 12 25 27
VCC_DDR: C19.2 C221.2 C222.2 C223.2 C224.2 R8.2 U4.H9(DDRPHY_VDDQ_1) U4.H11(DDRPHY_VDDQ_2) U4.H12(DDRPHY_VDDQ_3) U4.H14(DDRPHY_VDDQ_4) U4.H15(DDRPHY_VDDQ_5) U4.J9(DDRPHY_VDDQ_6) U4.L9(DDRPHY_VDDQ_7) U4.M9(DDRPHY_VDDQ_8) ; also on sheet 6 25 26
VCCA1V8_IMAGE: C63.2 U4.W18(HDMI_TX_AVDD_1V8) ; also on sheet 25
VCCA_1V8: C46.2 C47.2 C48.2 C50.2 C56.2 R23.2 U4.H22(SARADC_AVDD_1V8) U4.R22(MULTI_PHY_AVDD_1V8) U4.U22(PCIE30_AVDD_1V8) ; also on sheet 5 25
VCCIO_ACODEC: C72.2 R10.1 U4.H17(VCCIO1) ; also on sheet 25
VCCIO_FLASH: C184.1 C185.1 C186.2 C187.2 R73.2 R74.1 R75.1 U3.C6(VCCQ) U3.M4(VCCQ) U3.N4(VCCQ) U3.P3(VCCQ) U3.P5(VCCQ) ; also on sheet 7 26
VCCIO_WL: C53.2 U4.J21(VCCIO4) ; also on sheet 25
VDD_CPU: C1.2 C3.2 C244.2 C342.2 C343.2 U4.J15(VDD_CPU_1) U4.K15(VDD_CPU_2) U4.K16(VDD_CPU_3) U4.K17(VDD_CPU_4) U4.K18(VDD_CPU_5) U4.L15(VDD_CPU_6) U4.L16(VDD_CPU_7) U4.L17(VDD_CPU_8) U4.L18(VDD_CPU_9) U4.M17(VDD_CPU_10) ; also on sheet 26
VDD_CPU_COM: U4.M15(VDD_CPU_COM) ; also on sheet 26
VDD_GPU: C7.2 C8.2 C11.2 C12.2 C14.2 U4.R13(VDD_GPU_1) U4.T13(VDD_GPU_2) U4.U11(VDD_GPU_3) U4.U12(VDD_GPU_4) U4.U13(VDD_GPU_5) ; also on sheet 25
VDD_LOGIC: C2.2 C6.2 C9.2 C10.2 C17.2 C219.2 C220.2 U4.L12(VDD_LOGIC_1) U4.M12(VDD_LOGIC_2) U4.N13(VDD_LOGIC_3) U4.N16(VDD_LOGIC_4) U4.P13(VDD_LOGIC_5) U4.P16(VDD_LOGIC_6) U4.R12(VDD_LOGIC_7) U4.R16(VDD_LOGIC_8) U4.T12(VDD_LOGIC_9) U4.T16(VDD_LOGIC_10) ; also on sheet 25
VDD_NPU: C13.2 C15.2 C16.2 C18.2 U4.M19(VDD_NPU_1) U4.N19(VDD_NPU_2) U4.P18(VDD_NPU_3) U4.P19(VDD_NPU_4) U4.P20(VDD_NPU_5) ; also on sheet 25
VDDA0V9_IMAGE: C60.2 C61.2 U4.V17(HDMI_TX_AVDD_0V9_1) U4.V18(HDMI_TX_AVDD_0V9_2) ; also on sheet 25
VDDA_0V9: C44.2 C45.2 C49.2 C51.2 U4.R20(MULTI_PHY_AVDD_0V9_1) U4.R21(MULTI_PHY_AVDD_0V9_2) U4.U20(PCIE30_AVDD_0V9_2) U4.U21(PCIE30_AVDD_0V9_1) ; also on sheet 5 25
4G_DISABLE_GPIO4_C2: U4.AF8(GPIO4_C2_D)
BT_UART_RX: U4.AG1(GPIO3_B1_D) U69.10(UART0_TX)
BT_UART_TX: U4.AF2(GPIO3_B2_D) U69.9(UART0_RX)
CAM0_GPIO: U4.AA1(GPIO3_D4_D) ; also on sheet 11
CAM1_GPIO: U4.AE2(GPIO3_B5_D)
CAM_SCL: R174.1 U4.V5(GPIO4_B5_D) ; also on sheet 11
CAM_SDA: R173.1 U4.V6(GPIO4_B4_D) ; also on sheet 11
CLK32KOUT: U4.E26(GPIO2_C6_D)
DDR_A0_A: U4.C2(AC11) ; also on sheet 6
DDR_A0_B: U4.B8(AC13) ; also on sheet 6
DDR_A1_A: U4.B1(AC2) ; also on sheet 6
DDR_A1_B: U4.A7(AC6) ; also on sheet 6
DDR_A2_A: U4.E4(AC15) ; also on sheet 6
DDR_A2_B: U4.E11(AC18) ; also on sheet 6
DDR_A3_A: U4.C4(AC12) ; also on sheet 6
DDR_A3_B: U4.D9(AC4) ; also on sheet 6
DDR_A4_A: U4.C5(AC14) ; also on sheet 6
DDR_A4_B: U4.E9(AC19) ; also on sheet 6
DDR_A5_A: U4.D5(AC16) ; also on sheet 6
DDR_A5_B: U4.B7(AC5) ; also on sheet 6
DDR_A_CKE0: U4.B3(AC22) ; also on sheet 6
DDR_A_CKE1: U4.F4(AC3) ; also on sheet 6
DDR_A_CLKN: U4.A4(AC24) ; also on sheet 6
DDR_A_CLKP: U4.B4(AC23) ; also on sheet 6
DDR_A_CS0: U4.A2(AC25) ; also on sheet 6
DDR_A_CS1: U4.B2(AC26) ; also on sheet 6
DDR_A_DQS0N: U4.G2(DDR_DQS0N_A) ; also on sheet 6
DDR_A_DQS0P: U4.G1(DDR_DQS0P_A) ; also on sheet 6
DDR_A_DQS1N: U4.L1(DDR_DQS1N_A) ; also on sheet 6
DDR_A_DQS1P: U4.L2(DDR_DQS1P_A) ; also on sheet 6
DDR_A_ODTCA: U4.C1(AC8) ; also on sheet 6
DDR_B_CKE0: U4.D6(AC10) ; also on sheet 6
DDR_B_CKE1: U4.E6(AC17) ; also on sheet 6
DDR_B_CLKN: U4.A5(AC9) ; also on sheet 6
DDR_B_CLKP: U4.B6(AC0) ; also on sheet 6
DDR_B_CS0: U4.D8(AC28) ; also on sheet 6
DDR_B_CS1: U4.E8(AC27) ; also on sheet 6
DDR_B_DQS0N: U4.B11(DDR_DQS0N_B) ; also on sheet 6
DDR_B_DQS0P: U4.A11(DDR_DQS0P_B) ; also on sheet 6
DDR_B_DQS1N: U4.A15(DDR_DQS1N_B) ; also on sheet 6
DDR_B_DQS1P: U4.B15(DDR_DQS1P_B) ; also on sheet 6
DDR_B_ODTCA: U4.A8(AC7) ; also on sheet 6
DDR_DM0_A: U4.H5(DDR_DM0_A) ; also on sheet 6
DDR_DM0_B: U4.D14(DDR_DM0_B) ; also on sheet 6
DDR_DM1_A: U4.J4(DDR_DM1_A) ; also on sheet 6
DDR_DM1_B: U4.E17(DDR_DM1_B) ; also on sheet 6
DDR_DQ0_A: U4.F2(DDR_DQ0_A) ; also on sheet 6
DDR_DQ0_B: U4.B10(DDR_DQ0_B) ; also on sheet 6
DDR_DQ1_A: U4.E1(DDR_DQ1_A) ; also on sheet 6
DDR_DQ1_B: U4.A9(DDR_DQ1_B) ; also on sheet 6
DDR_DQ2_A: U4.E2(DDR_DQ2_A) ; also on sheet 6
DDR_DQ2_B: U4.D12(DDR_DQ2_B) ; also on sheet 6
DDR_DQ3_A: U4.D1(DDR_DQ3_A) ; also on sheet 6
DDR_DQ3_B: U4.E12(DDR_DQ3_B) ; also on sheet 6
DDR_DQ4_A: U4.J1(DDR_DQ4_A) ; also on sheet 6
DDR_DQ4_B: U4.A12(DDR_DQ4_B) ; also on sheet 6
DDR_DQ5_A: U4.J2(DDR_DQ5_A) ; also on sheet 6
DDR_DQ5_B: U4.D15(DDR_DQ5_B) ; also on sheet 6
DDR_DQ6_A: U4.H1(DDR_DQ6_A) ; also on sheet 6
DDR_DQ6_B: U4.E15(DDR_DQ6_B) ; also on sheet 6
DDR_DQ7_A: U4.H4(DDR_DQ7_A) ; also on sheet 6
DDR_DQ7_B: U4.E14(DDR_DQ7_B) ; also on sheet 6
DDR_DQ8_A: U4.M1(DDR_DQ8_A) ; also on sheet 6
DDR_DQ8_B: U4.A16(DDR_DQ8_B) ; also on sheet 6
DDR_DQ9_A: U4.N2(DDR_DQ9_A) ; also on sheet 6
DDR_DQ9_B: U4.B17(DDR_DQ9_B) ; also on sheet 6
DDR_DQ10_A: U4.L7(DDR_DQ10_A) ; also on sheet 6
DDR_DQ10_B: U4.A17(DDR_DQ10_B) ; also on sheet 6
DDR_DQ11_A: U4.L6(DDR_DQ11_A) ; also on sheet 6
DDR_DQ11_B: U4.B18(DDR_DQ11_B) ; also on sheet 6
DDR_DQ12_A: U4.K2(DDR_DQ12_A) ; also on sheet 6
DDR_DQ12_B: U4.B13(DDR_DQ12_B) ; also on sheet 6
DDR_DQ13_A: U4.J6(DDR_DQ13_A) ; also on sheet 6
DDR_DQ13_B: U4.A13(DDR_DQ13_B) ; also on sheet 6
DDR_DQ14_A: U4.J7(DDR_DQ14_A) ; also on sheet 6
DDR_DQ14_B: U4.D17(DDR_DQ14_B) ; also on sheet 6
DDR_DQ15_A: U4.L4(DDR_DQ15_A) ; also on sheet 6
DDR_DQ15_B: U4.B14(DDR_DQ15_B) ; also on sheet 6
DDR_RESET: U4.F11(AC29) ; also on sheet 6
EMMC_CLKOUT/FLASH_DQS: U3.M6(CLK) ; also on sheet 7
EMMC_CMD/FLASH_WRN: R75.2 U3.M5(CMD) ; also on sheet 7
EMMC_D0/FLASH_D0: R73.1 U3.A3(DAT0) ; also on sheet 7
EMMC_D1/FLASH_D1: U3.A4(DAT1) ; also on sheet 7
EMMC_D2/FLASH_D2: U3.A5(DAT2) ; also on sheet 7
EMMC_D3/FLASH_D3: U3.B2(DAT3) ; also on sheet 7
EMMC_D4/FLASH_D4: U3.B3(DAT4) ; also on sheet 7
EMMC_D5/FLASH_D5: U3.B4(DAT5) ; also on sheet 7
EMMC_D6/FLASH_D6: U3.B5(DAT6) ; also on sheet 7
EMMC_D7/FLASH_D7: U3.B6(DAT7) ; also on sheet 7
EMMC_DATA_STROBE/FLASH_CLE: R76.2 U3.H5(DS) ; also on sheet 7
EMMC_RSTN/FSPI_D2/FLASH_WPN: C193.2 R74.2 U3.K5(RST_n) ; also on sheet 7
GAMC1_MDIO_M0: U4.AC2(GPIO3_C5_D) ; also on sheet 8
GMAC0_INT/PMEB_GPIO3_C0: R171.1 U4.AD2(GPIO3_C0_D) ; also on sheet 27
GMAC0_MCLKINOUT: U4.F25(GPIO2_C2_D) ; also on sheet 27
GMAC0_MDC: R20.1 ; also on sheet 27
GMAC0_MDIO: U4.H23(GPIO2_C4_D) ; also on sheet 27
GMAC0_RSTN_GPIO3_B7: U4.AD4(GPIO3_B7_D) ; also on sheet 27
GMAC0_RXCLK: U4.B28(GPIO2_A5_U) ; also on sheet 27
GMAC0_RXD0: U4.F27(GPIO2_B6_U) ; also on sheet 27
GMAC0_RXD1: U4.H25(GPIO2_B7_D) ; also on sheet 27
GMAC0_RXD2: U4.E27(GPIO2_A3_U) ; also on sheet 27
GMAC0_RXD3: U4.E28(GPIO2_A4_U) ; also on sheet 27
GMAC0_RXDV_CRS: U4.F24(GPIO2_C0_D) ; also on sheet 27
GMAC0_RXER: U4.F26(GPIO2_C5_D)
GMAC0_TXCLK: R14.1 ; also on sheet 27
GMAC0_TXD0: R15.1 ; also on sheet 27
GMAC0_TXD1: R16.1 ; also on sheet 27
GMAC0_TXD2: R22.1 ; also on sheet 27
GMAC0_TXD3: R13.1 ; also on sheet 27
GMAC0_TXEN: R11.2 R17.1 ; also on sheet 27
GMAC1_INT/PMEB_GPIO3_A7: U4.AH2(GPIO3_A7_D) ; also on sheet 8
GMAC1_MCLKINOUT_M1: U4.U2(GPIO4_C1_D)
GMAC1_MDC_M0: U4.AC3(GPIO3_C4_D) ; also on sheet 8
GMAC1_MDIO_M1: U4.U4(GPIO4_B7_D)
GMAC1_RSTN_GPIO3_B0: U4.AG2(GPIO3_B0_D) ; also on sheet 8
GMAC1_RXCLK_M1: U4.Y3(GPIO4_A3_D)
GMAC1_RXD0_M1: U4.W1(GPIO4_A7_D)
GMAC1_RXD1_M1: U4.V7(GPIO4_B0_D)
GMAC1_RXD2_M1: U4.AA2(GPIO4_A1_D)
GMAC1_RXD3_M1: U4.Y4(GPIO4_A2_D)
GMAC1_RXDV_CRS_M1: U4.V2(GPIO4_B1_D)
GMAC1_RXER_M1/GPIO4_B2: U4.V4(GPIO4_B2_D)
GPIO3_B6: U4.AE3(GPIO3_B6_D)
GPIO3_D1: U4.AB1(GPIO3_D1_D)
HDMI_TX0N_PORT: R35.2 ; also on sheet 9
HDMI_TX0P_PORT: R34.2 ; also on sheet 9
HDMI_TX1N_PORT: R33.2 ; also on sheet 9
HDMI_TX1P_PORT: R21.2 ; also on sheet 9
HDMI_TX2N_PORT: R9.2 ; also on sheet 9
HDMI_TX2P_PORT: R19.2 ; also on sheet 9
HDMI_TX_HPDIN: C58.2 U4.AB18(HDMI_TX_HPDIN) ; also on sheet 9
HDMI_TXCLKN_PORT: R37.2 ; also on sheet 9
HDMI_TXCLKP_PORT: R36.2 ; also on sheet 9
HDMIRX_DET_L_GPIO3_D0: U4.AB5(GPIO3_D0_D)
HDMIRX_INT_L_GPIO4_C3: U4.AA11(GPIO4_C3_D)
HDMIRX_RST_L_GPIO4_D2: U4.AB9(GPIO4_D2_D)
HDMITX_CEC_M0: U4.AH6(GPIO4_D1_U) ; also on sheet 9
HDMITX_SCL: U4.AG8(GPIO4_C7_U) ; also on sheet 9
HDMITX_SDA: U4.AG7(GPIO4_D0_U) ; also on sheet 9
HP_DET_L_GPIO3_C2: U4.AA7(GPIO3_C2_D)
HP_L: R379.1 ; also on sheet 25
HP_R: R380.1 ; also on sheet 25
HP_SNS: R381.1 ; also on sheet 25
I2C1_SCL_TP: FPC2.3 ; also on sheet 5
I2C1_SDA_TP: FPC2.2 ; also on sheet 5
I2C3_SCL_M0: U4.E18(GPIO1_A1_U)
I2C3_SDA_M0: U4.D18(GPIO1_A0_U)
I2C5_SCL_M0: U4.AF1(GPIO3_B3_D)
I2C5_SDA_M0: U4.AE1(GPIO3_B4_D)
I2S1_LRCK_TX_M0_RK809: U4.A20(GPIO1_A5_D) ; also on sheet 25
I2S1_MCLK_M0_RK809: U4.A19(GPIO1_A2_D) ; also on sheet 25
I2S1_SCLK_TX_M0_RK809: U4.B19(GPIO1_A3_D) ; also on sheet 25
I2S1_SDI0_M0/PDM_SDI0_M0_RK809: U4.B21(GPIO1_B3_D) ; also on sheet 25
I2S1_SDO0_M0_RK809: U4.B20(GPIO1_A7_D) ; also on sheet 25
I2S3_MCLK_M0: U4.AE5(GPIO3_A2_D)
I2S3_SDI_M0: U4.AG3(GPIO3_A6_D)
I2S3_SDO_M0: U4.AH3(GPIO3_A5_D)
LCD0_BL_PWM4: R320.2 U79.4(EN/PWM) ; also on sheet 5
LCD_3V3: C543.2 FPC1.30 FPC1.31 L24.2
LCD_BK_A: C108.2 D32.2(K) FPC1.1 FPC1.2 FPC1.3 U79.5(OVP)
LCD_BK_K: FPC1.5 FPC1.6 FPC1.7 FPC1.8 R321.2 R322.2 U79.3(FB)
LCD_CKN: FPC1.18 U4.AG15(MIPI_DSI_TX0_CLKN/LVDS_TX0_CLKN)
LCD_CKP: FPC1.17 U4.AH15(MIPI_DSI_TX0_CLKP/LVDS_TX0_CLKP)
LCD_D0N: FPC1.21 U4.AG17(MIPI_DSI_TX0_D0N/LVDS_TX0_D0N)
LCD_D0P: FPC1.20 U4.AH17(MIPI_DSI_TX0_D0P/LVDS_TX0_D0P)
LCD_D1N: FPC1.15 U4.AG16(MIPI_DSI_TX0_D1N/LVDS_TX0_D1N)
LCD_D1P: FPC1.14 U4.AH16(MIPI_DSI_TX0_D1P/LVDS_TX0_D1P)
LCD_D2N: FPC1.12 U4.AG14(MIPI_DSI_TX0_D2N/LVDS_TX0_D2N)
LCD_D2P: FPC1.11 U4.AH14(MIPI_DSI_TX0_D2P/LVDS_TX0_D2P)
LCD_D3N: FPC1.24 U4.AG13(MIPI_DSI_TX0_D3N/LVDS_TX0_D3N)
LCD_D3P: FPC1.23 U4.AH13(MIPI_DSI_TX0_D3P/LVDS_TX0_D3P)
LCD_EN_H_GPIO3_C6: U4.AC5(GPIO3_C6_D)
LCD_RST: FPC1.27 U4.AA6(GPIO3_C7_D)
MIC1_INP: C198.1 MIC1.1 R43.1 U14.2 ; also on sheet 25
MIPI_AVDD_0V9: C64.2 U4.W16(MIPI_DSI_TX0/LVDS_TX0_AVDD_0V9) ; also on sheet 1 25
MIPI_AVDD_1V8: C66.2 U4.Y17(MIPI_DSI_TX0/LVDS_TX0_AVDD_1V8) ; also on sheet 1 25
MIPI_CAM0_PDN_L_GPIO3_D5: U4.AA5(GPIO3_D5_D)
MIPI_CAM1_PDN_L_GPIO3_D3: U4.AC1(GPIO3_D3_D)
MIPI_CAM1_RST_L_GPIO3_D2: U4.Y7(GPIO3_D2_D)
PCIE20_CLKREQN_M1: U4.AG6(GPIO2_D0_D) ; also on sheet 8
PCIE20_PERSTN_M1: U4.AD1(GPIO3_C1_D) ; also on sheet 8
PCIE20_REFCLKN: U4.V25(PCIE20_REFCLKN) ; also on sheet 8
PCIE20_REFCLKP: U4.V24(PCIE20_REFCLKP) ; also on sheet 8
PCIE20_RXN: U4.Y28(PCIE20_RXN/SATA2_RXN/QSGMII_RXN_M1) ; also on sheet 8
PCIE20_RXP: U4.Y27(PCIE20_RXP/SATA2_RXP/QSGMII_RXP_M1) ; also on sheet 8
PCIE20_TXN: U4.W28(PCIE20_TXN/SATA2_TXN/QSGMII_TXN_M1) ; also on sheet 8
PCIE20_TXP: U4.W27(PCIE20_TXP/SATA2_TXP/QSGMII_TXP_M1) ; also on sheet 8
PCIE20_WAKEN_M1: U4.AD7(GPIO2_D1_D) ; also on sheet 8
PCIE30_REFCLKN_IN: U4.AA25(PCIE30_REFCLKN_IN)
PCIE30_REFCLKP_IN: U4.Y25(PCIE30_REFCLKP_IN)
PCIE30_RX0N: U4.AC27(PCIE30_RX0N)
PCIE30_RX0P: U4.AC28(PCIE30_RX0P)
PCIE30_RX1N: U4.AD27(PCIE30_RX1N)
PCIE30_RX1P: U4.AD28(PCIE30_RX1P)
PCIE30_TX0N: U4.AA27(PCIE30_TX0N)
PCIE30_TX0P: U4.AA28(PCIE30_TX0P)
PCIE30_TX1N: U4.AB27(PCIE30_TX1N)
PCIE30_TX1P: U4.AB28(PCIE30_TX1P)
PCIE30X1_CLKREQN_M1: U4.AC8(GPIO2_D2_D)
PCIE30X1_PERSTN_M1: U4.AB8(GPIO3_A1_D)
PCIE30X1_PRSNT_L_GPIO3_A0: U4.AH4(GPIO3_A0_D)
PCIE30X1_WAKEN_M1: U4.AC7(GPIO2_D3_D)
PCIE30X2_CLKREQN_M1: U4.AF5(GPIO2_D4_D)
PCIE30X2_PERSTN_M1: U4.AD6(GPIO2_D6_D)
PCIE30X2_PRSNT_L_GPIO2_D7: U4.AH5(GPIO2_D7_D)
PCIE30X2_WAKEN_M1: U4.AF6(GPIO2_D5_D)
PDM_CLK0_M0_RK809: U4.C20(GPIO1_A6_D) ; also on sheet 25
PDM_CLK1_M0_ADC: U4.F18(GPIO1_A4_D)
PDM_SDI1_M0_ADC: U4.A21(GPIO1_B2_D)
PDM_SDI2_M0_ADC: U4.E20(GPIO1_B1_D)
PDM_SDI3_M0_ADC: U4.D20(GPIO1_B0_D)
SARADC_VIN0_KEY/RECOVERY: C200.1 R23.1 R47.2 U4.B27(SARADC_VIN0)
SATA2_ACT_LED: U4.AH7(GPIO4_C4_D)
SOC_RECOVERY: R47.1 RST2.1 RST2.2 U11.1
SPK_CTL_H_GPIO3_C3: U4.AC4(GPIO3_C3_D)
SPKN_OUT: U17.1 U19.2 ; also on sheet 25
SPKP_OUT: U17.2 U18.2 ; also on sheet 25
TP_INT: FPC2.4 ; also on sheet 5
TP_RST: FPC2.5 ; also on sheet 5
UART9_RX: R40.2 U4.AE8(GPIO4_C6_D)
UART9_TX: R41.2 U4.AD8(GPIO4_C5_D)
USB2_HOST2_DM: U4.R1(USB2_HOST2_DM) U69.4(USB_DM)
USB2_HOST2_DP: U4.R2(USB2_HOST2_DP) U69.5(USB_DP)
USB2_HOST3_DM: U4.T1(USB2_HOST3_DM)
USB2_HOST3_DP: U4.T2(USB2_HOST3_DP)
USB3_HOST1_DM: U4.P25(USB3_HOST1_DM) ; also on sheet 10
USB3_HOST1_DP: U4.P24(USB3_HOST1_DP) ; also on sheet 10
USB3_HOST1_SSRXN: U4.U27(USB3_HOST1_SSRXN/SATA1_RXN/QSGMII_RXN_M0) ; also on sheet 10
USB3_HOST1_SSRXP: U4.U28(USB3_HOST1_SSRXP/SATA1_RXP/QSGMII_RXP_M0) ; also on sheet 10
USB3_HOST1_SSTXN: U4.V27(USB3_HOST1_SSTXN/SATA1_TXN/QSGMII_TXN_M0) ; also on sheet 10
USB3_HOST1_SSTXP: U4.V28(USB3_HOST1_SSTXP/SATA1_TXP/QSGMII_TXP_M0) ; also on sheet 10
USB3_OTG0_DM: U4.P28(USB3_OTG0_DM) ; also on sheet 10
USB3_OTG0_DP: U4.P27(USB3_OTG0_DP) ; also on sheet 10
USB3_OTG0_ID: U4.L23(USB3_OTG0_ID)
USB3_OTG0_SSRXN: U4.R27(USB3_OTG0_SSRXN/SATA0_RXN)
USB3_OTG0_SSRXP: U4.R28(USB3_OTG0_SSRXP/SATA0_RXP)
USB3_OTG0_SSTXN: U4.T27(USB3_OTG0_SSTXN/SATA0_TXN)
USB3_OTG0_SSTXP: U4.T28(USB3_OTG0_SSTXP/SATA0_TXP)
USB3_OTG0_VBUSDET: C37.2 U4.M24(USB3_OTG0_VBUSDET) ; also on sheet 10
USB_AVDD_0V9: C40.2 C43.2 U4.P22(USB3_AVDD_0V9) U4.R8(USB2_AVDD_0V9) ; also on sheet 25
USB_AVDD_1V8: C39.2 C42.2 U4.P9(USB2_AVDD_1V8) U4.P23(USB3_AVDD_1V8) ; also on sheet 25
$2N938: H2.3 R41.1 U12.1
$2N940: H2.2 R40.1 U13.1
$5N1137: R8.1 U4.H7(DDR_RZQ)
$7N2367: R12.1 U4.U19(PCIE30_RESREF)
$12N934: C188.2 U3.C2(VDDI)
$15N2488: R22.2 U4.C27(GPIO2_A6_U)
$15N2518: R13.2 U4.C28(GPIO2_A7_U)
$15N2548: R14.2 U4.D27(GPIO2_B0_D)
$15N2578: R15.2 U4.F28(GPIO2_B3_U)
$15N2608: R16.2 U4.G27(GPIO2_B4_U)
$15N2662: R20.2 U4.H24(GPIO2_C3_D)
$15N2722: R17.2 U4.G28(GPIO2_B5_U)
$16N1393: R32.1 U4.AA18(HDMI_TX_REXT)
$16N5765: R19.1 U4.AG22(HDMI_TX_D2P)
$16N5767: R9.1 U4.AH22(HDMI_TX_D2N)
$16N5769: R21.1 U4.AG21(HDMI_TX_D1P)
$16N5771: R33.1 U4.AH21(HDMI_TX_D1N)
$16N5773: R34.1 U4.AG20(HDMI_TX_D0P)
$16N5775: R35.1 U4.AH20(HDMI_TX_D0N)
$16N5777: R36.1 U4.AH19(HDMI_TX_CLKP)
$16N5780: R37.1 U4.AG19(HDMI_TX_CLKN)
$25N321: C530.2 U69.2(ANT0)
$25N333: C530.1 RF1.1(SIG)
$26N115: CN3.1 R381.2 U84.2
$26N232: CN3.2 R379.2 U83.2
$26N265: CN3.3 R380.2 U82.2
$26N500: C197.1 R10.2 R43.2
$27N953: D32.1(A) L16.1 U79.1(LX)

Not connected (* = marked no-connect by the designer): FPC1 4* 26*; U3 G3(RFU); U4 AA3(GPIO4_A0_D) AC14(MIPI_DSI_TX1_D2N)* AC17(MIPI_DSI_TX1_D1N)* AD12(MIPI_DSI_TX1_D3P)* AD14(MIPI_DSI_TX1_D2P)* AD15(MIPI_DSI_TX1_CLKP)* AD17(MIPI_DSI_TX1_D1P)* AD18(MIPI_DSI_TX1_D0P)* AE12(MIPI_DSI_TX1_D3N)* AE15(MIPI_DSI_TX1_CLKN)* AE18(MIPI_DSI_TX1_D0N)* AF4(GPIO3_A4_D) AG4(GPIO3_A3_D) C26(SARADC_VIN1)* D24(SARADC_VIN2)* D26(GPIO2_B1_D)* E23(SARADC_VIN3)* E25(GPIO2_B2_U)* F5(AC1)* F7(AC21)* F8(AC20)* F21(SARADC_VIN7)* F22(SARADC_VIN5)* G20(SARADC_VIN6)* G21(SARADC_VIN4)* G23(GPIO2_C1_D)* J28(EDP_TX_D0P)* K27(EDP_TX_D0N)* K28(EDP_TX_D1P)* L25(EDP_TX_AUXP)* L27(EDP_TX_D1N)* L28(EDP_TX_D2P)* M4(DDR_ECC_DQ1)* M5(DDR_ECC_DQ2)* M7(DDR_ECC_DQ4)* M25(EDP_TX_AUXN)* M27(EDP_TX_D2N)* M28(EDP_TX_D3P)* N27(EDP_TX_D3N)* P1(DDR_ECC_DQS_N)* P2(DDR_ECC_DQS_P)* P4(DDR_ECC_DQ6)* P5(DDR_ECC_DQ0)* P7(DDR_ECC_DM)* P8(DDR_VREFOUT)* R4(DDR_ECC_DQ7)* R5(DDR_ECC_DQ3)* R7(DDR_ECC_DQ5)* R24(MULTI_PHY0_REFCLKP)* R25(MULTI_PHY0_REFCLKN)* U3(GPIO4_C0_D) U5(GPIO4_B6_D) U24(MULTI_PHY1_REFCLKN)* U25(MULTI_PHY1_REFCLKP)* V1(GPIO4_B3_D) W2(GPIO4_A6_D) Y1(GPIO4_A5_D) Y2(GPIO4_A4_D) Y5(GPIO3_D7_D) Y6(GPIO3_D6_D)

## Notes on the sheets
sheet 14
- DNP
- 8路 SARADC
sheet 15
- 兼容常见的31P MIPI屏幕4Lane
sheet 18
- DDR4 DDR3 LPDDR3 120下拉
  LPDDR4 LPDDR4x 120上拉
- 参考电压 LPDDR4不需要
sheet 20
- U: 默认内部上拉
  D: 默认内部下拉
  Z: 默认内部高阻抗
- 预留
- 预留
- 预留
- 双千兆网预留
- 预留
- 预留
- 预留
- 独立声卡解码器预留
  ES8388解码器和功放
sheet 22
- Diff 90 Ohm ±10%
- Diff 90 Ohm ±10%
- Diff 90 Ohm ±10%
- Diff 90 Ohm ±10%
- Diff 90 Ohm ±10%
- Diff 90 Ohm ±10%
- SATA OTG PCIE共用
- Diff 90 Ohm ±10%
- Diff 85 Ohm ±10%
- Diff 90 Ohm ±10%
- Diff 85 Ohm ±10%
- Diff 100 Ohm ±10%
- Diff 85 Ohm ±10%
- Diff 85 Ohm ±10%
- Diff 100 Ohm ±10%
- Diff 100 Ohm ±10%
- Diff 100 Ohm ±10%
sheet 23
- 电源反馈脚
  连接DCDC的FB
  改善走线带来的压降
sheet 24
- 默认高电平
  低电平-> Maskrom
- 默认BGA153
